# Altium project MU_MP_39_V1.PrjPcb (part 4 of 5)

## Sheet 15 ETHERNET.SchDoc
size 420 x 297 mm; Address1: Address1; Address2: Address2; Address3: Address3; Address4: Address4; DocumentNumber: АБВГ.123456.001 Э3; SheetNumber: 15; SheetTotal: 23; Scale: 1:1; DocumentType: Схема электрическая принципиальная; FirstReferrence: АБВГ.123456.001
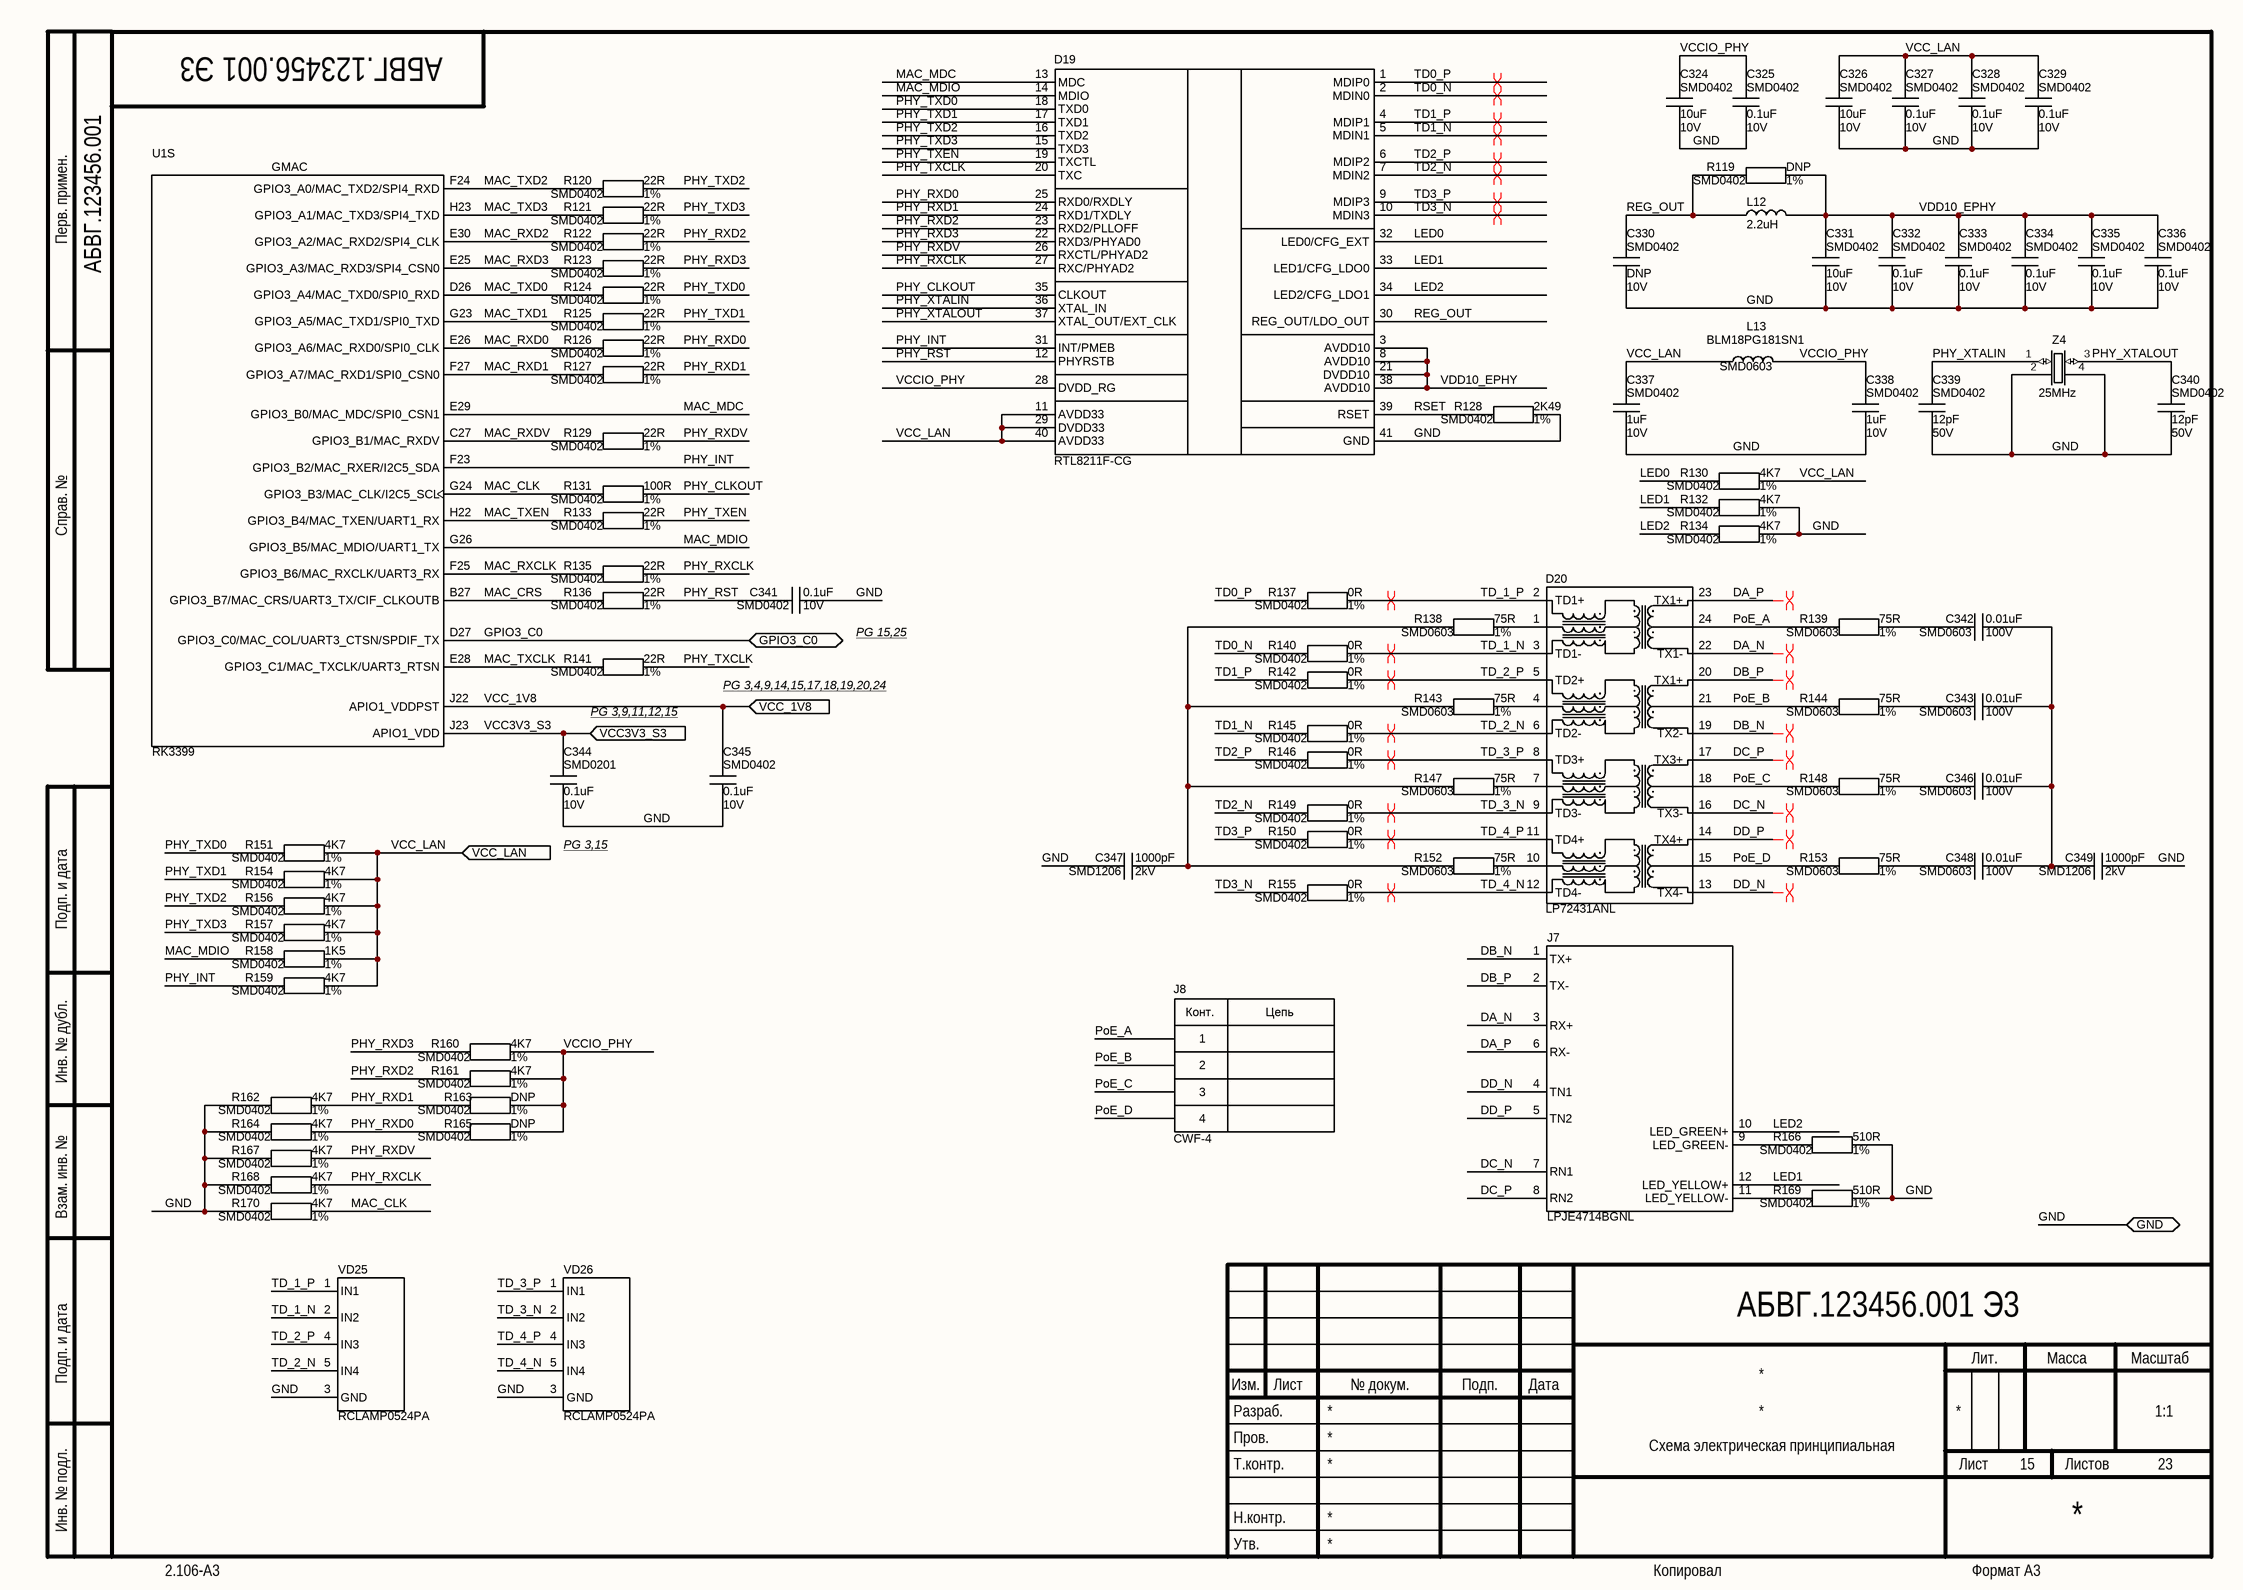
[diagram p14: 15 ETHERNET.SchDoc]

### Parts
C324  Package: SMD0402  Voltage: 10V  [CAP_SMD_0402]  (hidden comment: 10uF)
C325  Package: SMD0402  Voltage: 10V  [CAP_SMD_0402]  (hidden comment: 0.1uF)
C326  Package: SMD0402  Voltage: 10V  [CAP_SMD_0402]  (hidden comment: 10uF)
C327  Package: SMD0402  Voltage: 10V  [CAP_SMD_0402]  (hidden comment: 0.1uF)
C328  Package: SMD0402  Voltage: 10V  [CAP_SMD_0402]  (hidden comment: 0.1uF)
C329  Package: SMD0402  Voltage: 10V  [CAP_SMD_0402]  (hidden comment: 0.1uF)
C330  Package: SMD0402  Voltage: 10V  [CAP_SMD_0402]  (hidden comment: DNP)
C331  Package: SMD0402  Voltage: 10V  [CAP_SMD_0402]  (hidden comment: 10uF)
C332  Package: SMD0402  Voltage: 10V  [CAP_SMD_0402]  (hidden comment: 0.1uF)
C333  Package: SMD0402  Voltage: 10V  [CAP_SMD_0402]  (hidden comment: 0.1uF)
C334  Package: SMD0402  Voltage: 10V  [CAP_SMD_0402]  (hidden comment: 0.1uF)
C335  Package: SMD0402  Voltage: 10V  [CAP_SMD_0402]  (hidden comment: 0.1uF)
C336  Package: SMD0402  Voltage: 10V  [CAP_SMD_0402]  (hidden comment: 0.1uF)
C337  Package: SMD0402  Voltage: 10V  [CAP_SMD_0402]  (hidden comment: 1uF)
C338  Package: SMD0402  Voltage: 10V  [CAP_SMD_0402]  (hidden comment: 1uF)
C339  Package: SMD0402  Voltage: 50V  [CAP_SMD_0402]  (hidden comment: 12pF)
C340  Package: SMD0402  Voltage: 50V  [CAP_SMD_0402]  (hidden comment: 12pF)
C341  Package: SMD0402  Voltage: 10V  [CAP_SMD_0402]  (hidden comment: 0.1uF)
C342  Package: SMD0603  Voltage: 100V  [CAP_SMD_0603]  (hidden comment: 0.01uF)
C343  Package: SMD0603  Voltage: 100V  [CAP_SMD_0603]  (hidden comment: 0.01uF)
C344  Package: SMD0201  Voltage: 10V  [CAP_SMD_0201]  (hidden comment: 0.1uF)
C345  Package: SMD0402  Voltage: 10V  [CAP_SMD_0402]  (hidden comment: 0.1uF)
C346  Package: SMD0603  Voltage: 100V  [CAP_SMD_0603]  (hidden comment: 0.01uF)
C347  Package: SMD1206  Voltage: 2kV  [CAP_SMD_1206]  (hidden comment: 1000pF)
C348  Package: SMD0603  Voltage: 100V  [CAP_SMD_0603]  (hidden comment: 0.01uF)
C349  Package: SMD1206  Voltage: 2kV  [CAP_SMD_1206]  (hidden comment: 1000pF)
D19  RTL8211F-CG  [QFN40]
D20  LP72431ANL  [LP72431ANL]
J7  LPJE4714BGNL  [LPJE4714BGNL]
J8  CWF-4  [CWF-4]
L12  value 2.2uH  [IND_SMD_252012]  (hidden comment: Value)
L13  value BLM18PG181SN1  Package: SMD0603  [IND_SMD_0603]  (hidden comment: Value)
R119  Package: SMD0402  Tolerance: 1%  [RES_SMD_0402]  (hidden comment: DNP)
R120  Package: SMD0402  Tolerance: 1%  [RES_SMD_0402]  (hidden comment: 22R)
R121  Package: SMD0402  Tolerance: 1%  [RES_SMD_0402]  (hidden comment: 22R)
R122  Package: SMD0402  Tolerance: 1%  [RES_SMD_0402]  (hidden comment: 22R)
R123  Package: SMD0402  Tolerance: 1%  [RES_SMD_0402]  (hidden comment: 22R)
R124  Package: SMD0402  Tolerance: 1%  [RES_SMD_0402]  (hidden comment: 22R)
R125  Package: SMD0402  Tolerance: 1%  [RES_SMD_0402]  (hidden comment: 22R)
R126  Package: SMD0402  Tolerance: 1%  [RES_SMD_0402]  (hidden comment: 22R)
R127  Package: SMD0402  Tolerance: 1%  [RES_SMD_0402]  (hidden comment: 22R)
R128  Package: SMD0402  Tolerance: 1%  [RES_SMD_0402]  (hidden comment: 2K49)
R129  Package: SMD0402  Tolerance: 1%  [RES_SMD_0402]  (hidden comment: 22R)
R130  Package: SMD0402  Tolerance: 1%  [RES_SMD_0402]  (hidden comment: 4K7)
R131  Package: SMD0402  Tolerance: 1%  [RES_SMD_0402]  (hidden comment: 100R)
R132  Package: SMD0402  Tolerance: 1%  [RES_SMD_0402]  (hidden comment: 4K7)
R133  Package: SMD0402  Tolerance: 1%  [RES_SMD_0402]  (hidden comment: 22R)
R134  Package: SMD0402  Tolerance: 1%  [RES_SMD_0402]  (hidden comment: 4K7)
R135  Package: SMD0402  Tolerance: 1%  [RES_SMD_0402]  (hidden comment: 22R)
R136  Package: SMD0402  Tolerance: 1%  [RES_SMD_0402]  (hidden comment: 22R)
R137  Package: SMD0402  Tolerance: 1%  [RES_SMD_0402]  (hidden comment: 0R)
R138  Package: SMD0603  Tolerance: 1%  [RES_SMD_0603]  (hidden comment: 75R)
R139  Package: SMD0603  Tolerance: 1%  [RES_SMD_0603]  (hidden comment: 75R)
R140  Package: SMD0402  Tolerance: 1%  [RES_SMD_0402]  (hidden comment: 0R)
R141  Package: SMD0402  Tolerance: 1%  [RES_SMD_0402]  (hidden comment: 22R)
R142  Package: SMD0402  Tolerance: 1%  [RES_SMD_0402]  (hidden comment: 0R)
R143  Package: SMD0603  Tolerance: 1%  [RES_SMD_0603]  (hidden comment: 75R)
R144  Package: SMD0603  Tolerance: 1%  [RES_SMD_0603]  (hidden comment: 75R)
R145  Package: SMD0402  Tolerance: 1%  [RES_SMD_0402]  (hidden comment: 0R)
R146  Package: SMD0402  Tolerance: 1%  [RES_SMD_0402]  (hidden comment: 0R)
R147  Package: SMD0603  Tolerance: 1%  [RES_SMD_0603]  (hidden comment: 75R)
R148  Package: SMD0603  Tolerance: 1%  [RES_SMD_0603]  (hidden comment: 75R)
R149  Package: SMD0402  Tolerance: 1%  [RES_SMD_0402]  (hidden comment: 0R)
R150  Package: SMD0402  Tolerance: 1%  [RES_SMD_0402]  (hidden comment: 0R)
R151  Package: SMD0402  Tolerance: 1%  [RES_SMD_0402]  (hidden comment: 4K7)
R152  Package: SMD0603  Tolerance: 1%  [RES_SMD_0603]  (hidden comment: 75R)
R153  Package: SMD0603  Tolerance: 1%  [RES_SMD_0603]  (hidden comment: 75R)
R154  Package: SMD0402  Tolerance: 1%  [RES_SMD_0402]  (hidden comment: 4K7)
R155  Package: SMD0402  Tolerance: 1%  [RES_SMD_0402]  (hidden comment: 0R)
R156  Package: SMD0402  Tolerance: 1%  [RES_SMD_0402]  (hidden comment: 4K7)
R157  Package: SMD0402  Tolerance: 1%  [RES_SMD_0402]  (hidden comment: 4K7)
R158  Package: SMD0402  Tolerance: 1%  [RES_SMD_0402]  (hidden comment: 1K5)
R159  Package: SMD0402  Tolerance: 1%  [RES_SMD_0402]  (hidden comment: 4K7)
R160  Package: SMD0402  Tolerance: 1%  [RES_SMD_0402]  (hidden comment: 4K7)
R161  Package: SMD0402  Tolerance: 1%  [RES_SMD_0402]  (hidden comment: 4K7)
R162  Package: SMD0402  Tolerance: 1%  [RES_SMD_0402]  (hidden comment: 4K7)
R163  Package: SMD0402  Tolerance: 1%  [RES_SMD_0402]  (hidden comment: DNP)
R164  Package: SMD0402  Tolerance: 1%  [RES_SMD_0402]  (hidden comment: 4K7)
R165  Package: SMD0402  Tolerance: 1%  [RES_SMD_0402]  (hidden comment: DNP)
R166  Package: SMD0402  Tolerance: 1%  [RES_SMD_0402]  (hidden comment: 510R)
R167  Package: SMD0402  Tolerance: 1%  [RES_SMD_0402]  (hidden comment: 4K7)
R168  Package: SMD0402  Tolerance: 1%  [RES_SMD_0402]  (hidden comment: 4K7)
R169  Package: SMD0402  Tolerance: 1%  [RES_SMD_0402]  (hidden comment: 510R)
R170  Package: SMD0402  Tolerance: 1%  [RES_SMD_0402]  (hidden comment: 4K7)
U1  value RK3399  [BGA828C65P31X31_2100X2100X161N]  (hidden comment: RK3399_FF)  (part S of 23)
VD25  RCLAMP0524PA  [RCLAMP0524PA]
VD26  RCLAMP0524PA  [RCLAMP0524PA]
Z4  value 25MHz  [TSX3225]  (hidden comment: Value)

### Ports
GND (bidir), GPIO3_C0 (bidir), VCC3V3_S3 (in), VCC_1V8 (in), VCC_LAN (in)

### Nets
DA_N: D20.22(TX1-) J7.3(RX+)
DA_P: D20.23(TX1+) J7.6(RX-)
DB_N: D20.19(TX2-) J7.1(TX+)
DB_P: D20.20(TX1+) J7.2(TX-)
DC_N: D20.16(TX3-) J7.7(RN1)
DC_P: D20.17(TX3+) J7.8(RN2)
DD_N: D20.13(TX4-) J7.4(TN1)
DD_P: D20.14(TX4+) J7.5(TN2)
GND: C324.2 C325.2 C326.2 C327.2 C328.2 C329.2 C330.2 C331.2 C332.2 C333.2 C334.2 C335.2 C336.2 C337.2 C338.2 C339.2 C340.2 C341.2 C344.2 C345.2 C347.2 C349.1 D19.41(GND) R128.2 R132.2 R134.2 R162.1 R164.1 R166.2 R167.1 R168.1 R169.2 R170.1 VD25.3(GND) VD26.3(GND) Z4.2(GND) Z4.4(GND) ; port GND
GPIO3_C0: U1.D27(GPIO3_C0/MAC_COL/UART3_CTSN/SPDIF_TX) ; port GPIO3_C0
LED0: D19.32(LED0/CFG_EXT) R130.1
LED1: D19.33(LED1/CFG_LDO0) J7.12(LED_YELLOW+) R132.1
LED2: D19.34(LED2/CFG_LDO1) J7.10(LED_GREEN+) R134.1
MAC_CLK: R131.1 R170.2 U1.G24(GPIO3_B3/MAC_CLK/I2C5_SCL)
MAC_CRS: R136.2 U1.B27(GPIO3_B7/MAC_CRS/UART3_TX/CIF_CLKOUTB)
MAC_MDC: D19.13(MDC) U1.E29(GPIO3_B0/MAC_MDC/SPI0_CSN1)
MAC_MDIO: D19.14(MDIO) R158.1 U1.G26(GPIO3_B5/MAC_MDIO/UART1_TX)
MAC_RXCLK: R135.2 U1.F25(GPIO3_B6/MAC_RXCLK/UART3_RX)
MAC_RXD0: R126.2 U1.E26(GPIO3_A6/MAC_RXD0/SPI0_CLK)
MAC_RXD1: R127.2 U1.F27(GPIO3_A7/MAC_RXD1/SPI0_CSN0)
MAC_RXD2: R122.2 U1.E30(GPIO3_A2/MAC_RXD2/SPI4_CLK)
MAC_RXD3: R123.2 U1.E25(GPIO3_A3/MAC_RXD3/SPI4_CSN0)
MAC_RXDV: R129.2 U1.C27(GPIO3_B1/MAC_RXDV)
MAC_TXCLK: R141.2 U1.E28(GPIO3_C1/MAC_TXCLK/UART3_RTSN)
MAC_TXD0: R124.2 U1.D26(GPIO3_A4/MAC_TXD0/SPI0_RXD)
MAC_TXD1: R125.2 U1.G23(GPIO3_A5/MAC_TXD1/SPI0_TXD)
MAC_TXD2: R120.2 U1.F24(GPIO3_A0/MAC_TXD2/SPI4_RXD)
MAC_TXD3: R121.2 U1.H23(GPIO3_A1/MAC_TXD3/SPI4_TXD)
MAC_TXEN: R133.2 U1.H22(GPIO3_B4/MAC_TXEN/UART1_RX)
PHY_CLKOUT: D19.35(CLKOUT) R131.2
PHY_INT: D19.31(INT/PMEB) R159.1 U1.F23(GPIO3_B2/MAC_RXER/I2C5_SDA)
PHY_RST: C341.1 D19.12(PHYRSTB) R136.1
PHY_RXCLK: D19.27(RXC/PHYAD2) R135.1 R168.2
PHY_RXD0: D19.25(RXD0/RXDLY) R126.1 R164.2 R165.1
PHY_RXD1: D19.24(RXD1/TXDLY) R127.1 R162.2 R163.1
PHY_RXD2: D19.23(RXD2/PLLOFF) R122.1 R161.1
PHY_RXD3: D19.22(RXD3/PHYAD0) R123.1 R160.1
PHY_RXDV: D19.26(RXCTL/PHYAD2) R129.1 R167.2
PHY_TXCLK: D19.20(TXC) R141.1
PHY_TXD0: D19.18(TXD0) R124.1 R151.1
PHY_TXD1: D19.17(TXD1) R125.1 R154.1
PHY_TXD2: D19.16(TXD2) R120.1 R156.1
PHY_TXD3: D19.15(TXD3) R121.1 R157.1
PHY_TXEN: D19.19(TXCTL) R133.1
PHY_XTALIN: C339.1 D19.36(XTAL_IN) Z4.1(IN/OUT)
PHY_XTALOUT: C340.1 D19.37(XTAL_OUT/EXT_CLK) Z4.3(IN/OUT)
PoE_A: D20.24(TCT_1) J8.1 R139.1
PoE_B: D20.21(TCT_2) J8.2 R144.1
PoE_C: D20.18(TCT_3) J8.3 R148.1
PoE_D: D20.15(TCT_4) J8.4 R153.1
REG_OUT: C330.1 D19.30(REG_OUT/LDO_OUT) L12.2 R119.1
RSET: D19.39(RSET) R128.1
TD0_N: D19.2(MDIN0) R140.1
TD0_P: D19.1(MDIP0) R137.1
TD1_N: D19.5(MDIN1) R145.1
TD1_P: D19.4(MDIP1) R142.1
TD2_N: D19.7(MDIN2) R149.1
TD2_P: D19.6(MDIP2) R146.1
TD3_N: D19.10(MDIN3) R155.1
TD3_P: D19.9(MDIP3) R150.1
TD_1_N: D20.3(TD1-) R140.2 VD25.2(IN2)
TD_1_P: D20.2(TD1+) R137.2 VD25.1(IN1)
TD_2_N: D20.6(TD2-) R145.2 VD25.5(IN4)
TD_2_P: D20.5(TD2+) R142.2 VD25.4(IN3)
TD_3_N: D20.9(TD3-) R149.2 VD26.2(IN2)
TD_3_P: D20.8(TD3+) R146.2 VD26.1(IN1)
TD_4_N: D20.12(TD4-) R155.2 VD26.5(IN4)
TD_4_P: D20.11(TD4+) R150.2 VD26.4(IN3)
VCC3V3_S3: C344.1 U1.J23(APIO1_VDD) ; port VCC3V3_S3
VCC_1V8: C345.1 U1.J22(APIO1_VDDPST) ; port VCC_1V8
VCC_LAN: C326.1 C327.1 C328.1 C329.1 C337.1 D19.11(AVDD33) D19.29(DVDD33) D19.40(AVDD33) L13.2 R130.2 R151.2 R154.2 R156.2 R157.2 R158.2 R159.2 ; port VCC_LAN
VCCIO_PHY: C324.1 C325.1 C338.1 D19.28(DVDD_RG) L13.1 R160.2 R161.2 R163.2 R165.2
VDD10_EPHY: C331.1 C332.1 C333.1 C334.1 C335.1 C336.1 D19.3(AVDD10) D19.8(AVDD10) D19.21(DVDD10) D19.38(AVDD10) L12.1 R119.2
NetC342_1: C342.1 C343.1 C346.1 C348.1 C349.2
NetC342_2: C342.2 R139.2
NetC343_2: C343.2 R144.2
NetC346_2: C346.2 R148.2
NetC347_1: C347.1 R138.2 R143.2 R147.2 R152.2
NetC348_2: C348.2 R153.2
NetD20_1: D20.1(TCT1) R138.1
NetD20_4: D20.4(TCT2) R143.1
NetD20_7: D20.7(TCT3) R147.1
NetD20_10: D20.10(TCT4) R152.1
NetJ7_9: J7.9(LED_GREEN-) R166.1
NetJ7_11: J7.11(LED_YELLOW-) R169.1

### Layout directives
differential pair; differential pair class DiffPair_1; net class DiffPair_1: DA_N, DA_P, DB_N, DB_P, DC_N, DC_P, DD_N, DD_P, TD0_N, TD0_P, TD1_N, TD1_P, TD2_N, TD2_P, TD3_N, TD3_P, TD_1_N, TD_1_P, TD_2_N, TD_2_P, TD_3_N, TD_3_P, TD_4_N, TD_4_P

### Notes on the sheet
- Перв. примен.
- Справ. №
- PG 15,25
- PG 3,9,11,12,15
- PG 3,4,9,14,15,17,18,19,20,24
- PG 3,15
- Подп. и дата
- Инв. № дубл.
- Взам. инв. №
- Разраб.
- Изм.
- Лист
- № докум.
- Подп.
- Дата
- Лит.
- Масса
- Масштаб
- Пров.
- Т.контр.
- Листов
- Инв. № подл.
- Утв.
- Н.контр.
- 2.106-A3
- Копировал
- Формат А3
- (in symbol CON4) Конт.; Цепь
- (in symbol RK3399_FF, part S) GMAC

### Library data of the parts
C324 C326 C331 = Ceramic_Cap: PartNumber: CC0402MRX5R6BB106; ComponentType: SMD Ceramic Chip Capacitor; Manufacter: *; Tolerance: *; ClassName: *; Value: 10uF
C325 C327-C330 C332-C336 C341 C345 = Ceramic_Cap: PartNumber: CC0402KRX5R6BB104; ComponentType: SMD Ceramic Chip Capacitor; Manufacter: *; Tolerance: *; ClassName: *
  C325 C327-C329 C332-C336 C341 C345: Value: 0.1uF
  C330: Value: DNP
C337 C338 = Ceramic_Cap: PartNumber: CC0402KRX5R6BB105; ComponentType: SMD Ceramic Chip Capacitor; Manufacter: *; Tolerance: *; ClassName: *; Value: 1uF
C339 C340 = Ceramic_Cap: PartNumber: CC0402JRNPO9BN120; ComponentType: SMD Ceramic Chip Capacitor; Manufacter: *; Tolerance: *; ClassName: *; Value: 12pF
C342 C343 C346 C348 = Ceramic_Cap: PartNumber: CC0603KRX7R0BB103; ComponentType: SMD Ceramic Chip Capacitor; Manufacter: *; Tolerance: *; ClassName: *; Value: 0.01uF
C344 = Ceramic_Cap: PartNumber: CC0201KRX5R6BB104; ComponentType: SMD Ceramic Chip Capacitor; Manufacter: *; Tolerance: *; ClassName: *; Value: 0.1uF
C347 C349 = Ceramic_Cap: PartNumber: CC1206MKX7RDBB102; ComponentType: SMD Ceramic Chip Capacitor; Manufacter: *; Tolerance: *; ClassName: *; Value: 1000pF
J8 = CON4: PartNumber: DS1069-4MVW6X (CWF-4); Manufacter: *; Package: CWF-4; ClassName: *; Value: CWF-4
L12 = Inductor_smal: PartNumber: DFE252012P-2R2M=P2; ComponentType: *; Manufacter: *; Package: SMD252012; ClassName: *
L13 = Inductor_smal: ComponentType: *; Manufacter: *; PartNumber: BLM18PG181SN1; ClassName: *
R119 R163 R165 = Chip_Res: PartNumber: Do Not Place; ComponentType: SMD Chip Resistor; Manufacter: *; Voltage: *; ClassName: *; Value: DNP
R120-R127 R129 R133 R135 R136 R141 = Chip_Res: PartNumber: RC0402FR-0722RL; ComponentType: SMD Chip Resistor; Manufacter: *; Voltage: *; ClassName: *; Value: 22R
R128 = Chip_Res: PartNumber: RC0402FR-072K49L; ComponentType: SMD Chip Resistor; Manufacter: *; Voltage: *; ClassName: *; Value: 2K49
R130 R132 R134 R151 R154 R156 R157 R159-R162 R164 R167 R168 R170 = Chip_Res: PartNumber: RC0402FR-074K7L; ComponentType: SMD Chip Resistor; Manufacter: *; Voltage: *; ClassName: *; Value: 4K7
R131 = Chip_Res: PartNumber: RC0402FR-07100RL; ComponentType: SMD Chip Resistor; Manufacter: *; Voltage: *; ClassName: *; Value: 100R
R137 R140 R142 R145 R146 R149 R150 R155 = Chip_Res: PartNumber: RC0402FR-070RL; ComponentType: SMD Chip Resistor; Manufacter: *; Voltage: *; ClassName: *; Value: 0R
R138 R139 R143 R144 R147 R148 R152 R153 = Chip_Res: PartNumber: RC0603FR-0775RL; ComponentType: SMD Chip Resistor; Manufacter: *; Voltage: *; ClassName: *; Value: 75R
R158 = Chip_Res: PartNumber: RC0402FR-071K5L; ComponentType: SMD Chip Resistor; Manufacter: *; Voltage: *; ClassName: *; Value: 1K5
R166 R169 = Chip_Res: PartNumber: RC0402FR-07510RL; ComponentType: SMD Chip Resistor; Manufacter: *; Voltage: *; ClassName: *; Value: 510R
Z4 = OSC3225: PartNumber: X322525MOB4SI; ComponentType: *; Manufacter: *; Package: TSX3225
D19 = RTL8211F-CG: ComponentType: SMD Chip Resistor; Manufacter: *; Voltage: *; ClassName: *; Tolerance: *; PartNumber: RTL8211F-CG; Package: QFN40; Value: RTL8211F-CG
D20 = LP72431ANL: ComponentType: *; Manufacter: *; Voltage: *; ClassName: *; Tolerance: *; PartNumber: LP72431ANL; Package: LP72431ANL; Value: LP72431ANL
J7 = LPJE4714BGNL: ComponentType: *; Manufacter: *; Voltage: *; ClassName: *; Tolerance: *; PartNumber: LPJE4714BGNL; Package: LPJE4714BGNL; Value: LPJE4714BGNL
U1 = RK3399_FF: Package: BGA828; ComponentType: *; Manufacter: *; PartNumber: RK3399; ClassName: *
VD25 VD26 = RCLAMP0524PA: ComponentType: *; Manufacter: *; Package: RCLAMP0524PA; PartNumber: RCLAMP0524PA; ClassName: *; Value: RCLAMP0524PA

## Sheet 16 HDMI.SchDoc
size 420 x 297 mm; Address1: Address1; Address2: Address2; Address3: Address3; Address4: Address4; DocumentNumber: АБВГ.123456.001 Э3; SheetNumber: 16; SheetTotal: 23; Scale: 1:1; DocumentType: Схема электрическая принципиальная; FirstReferrence: АБВГ.123456.001
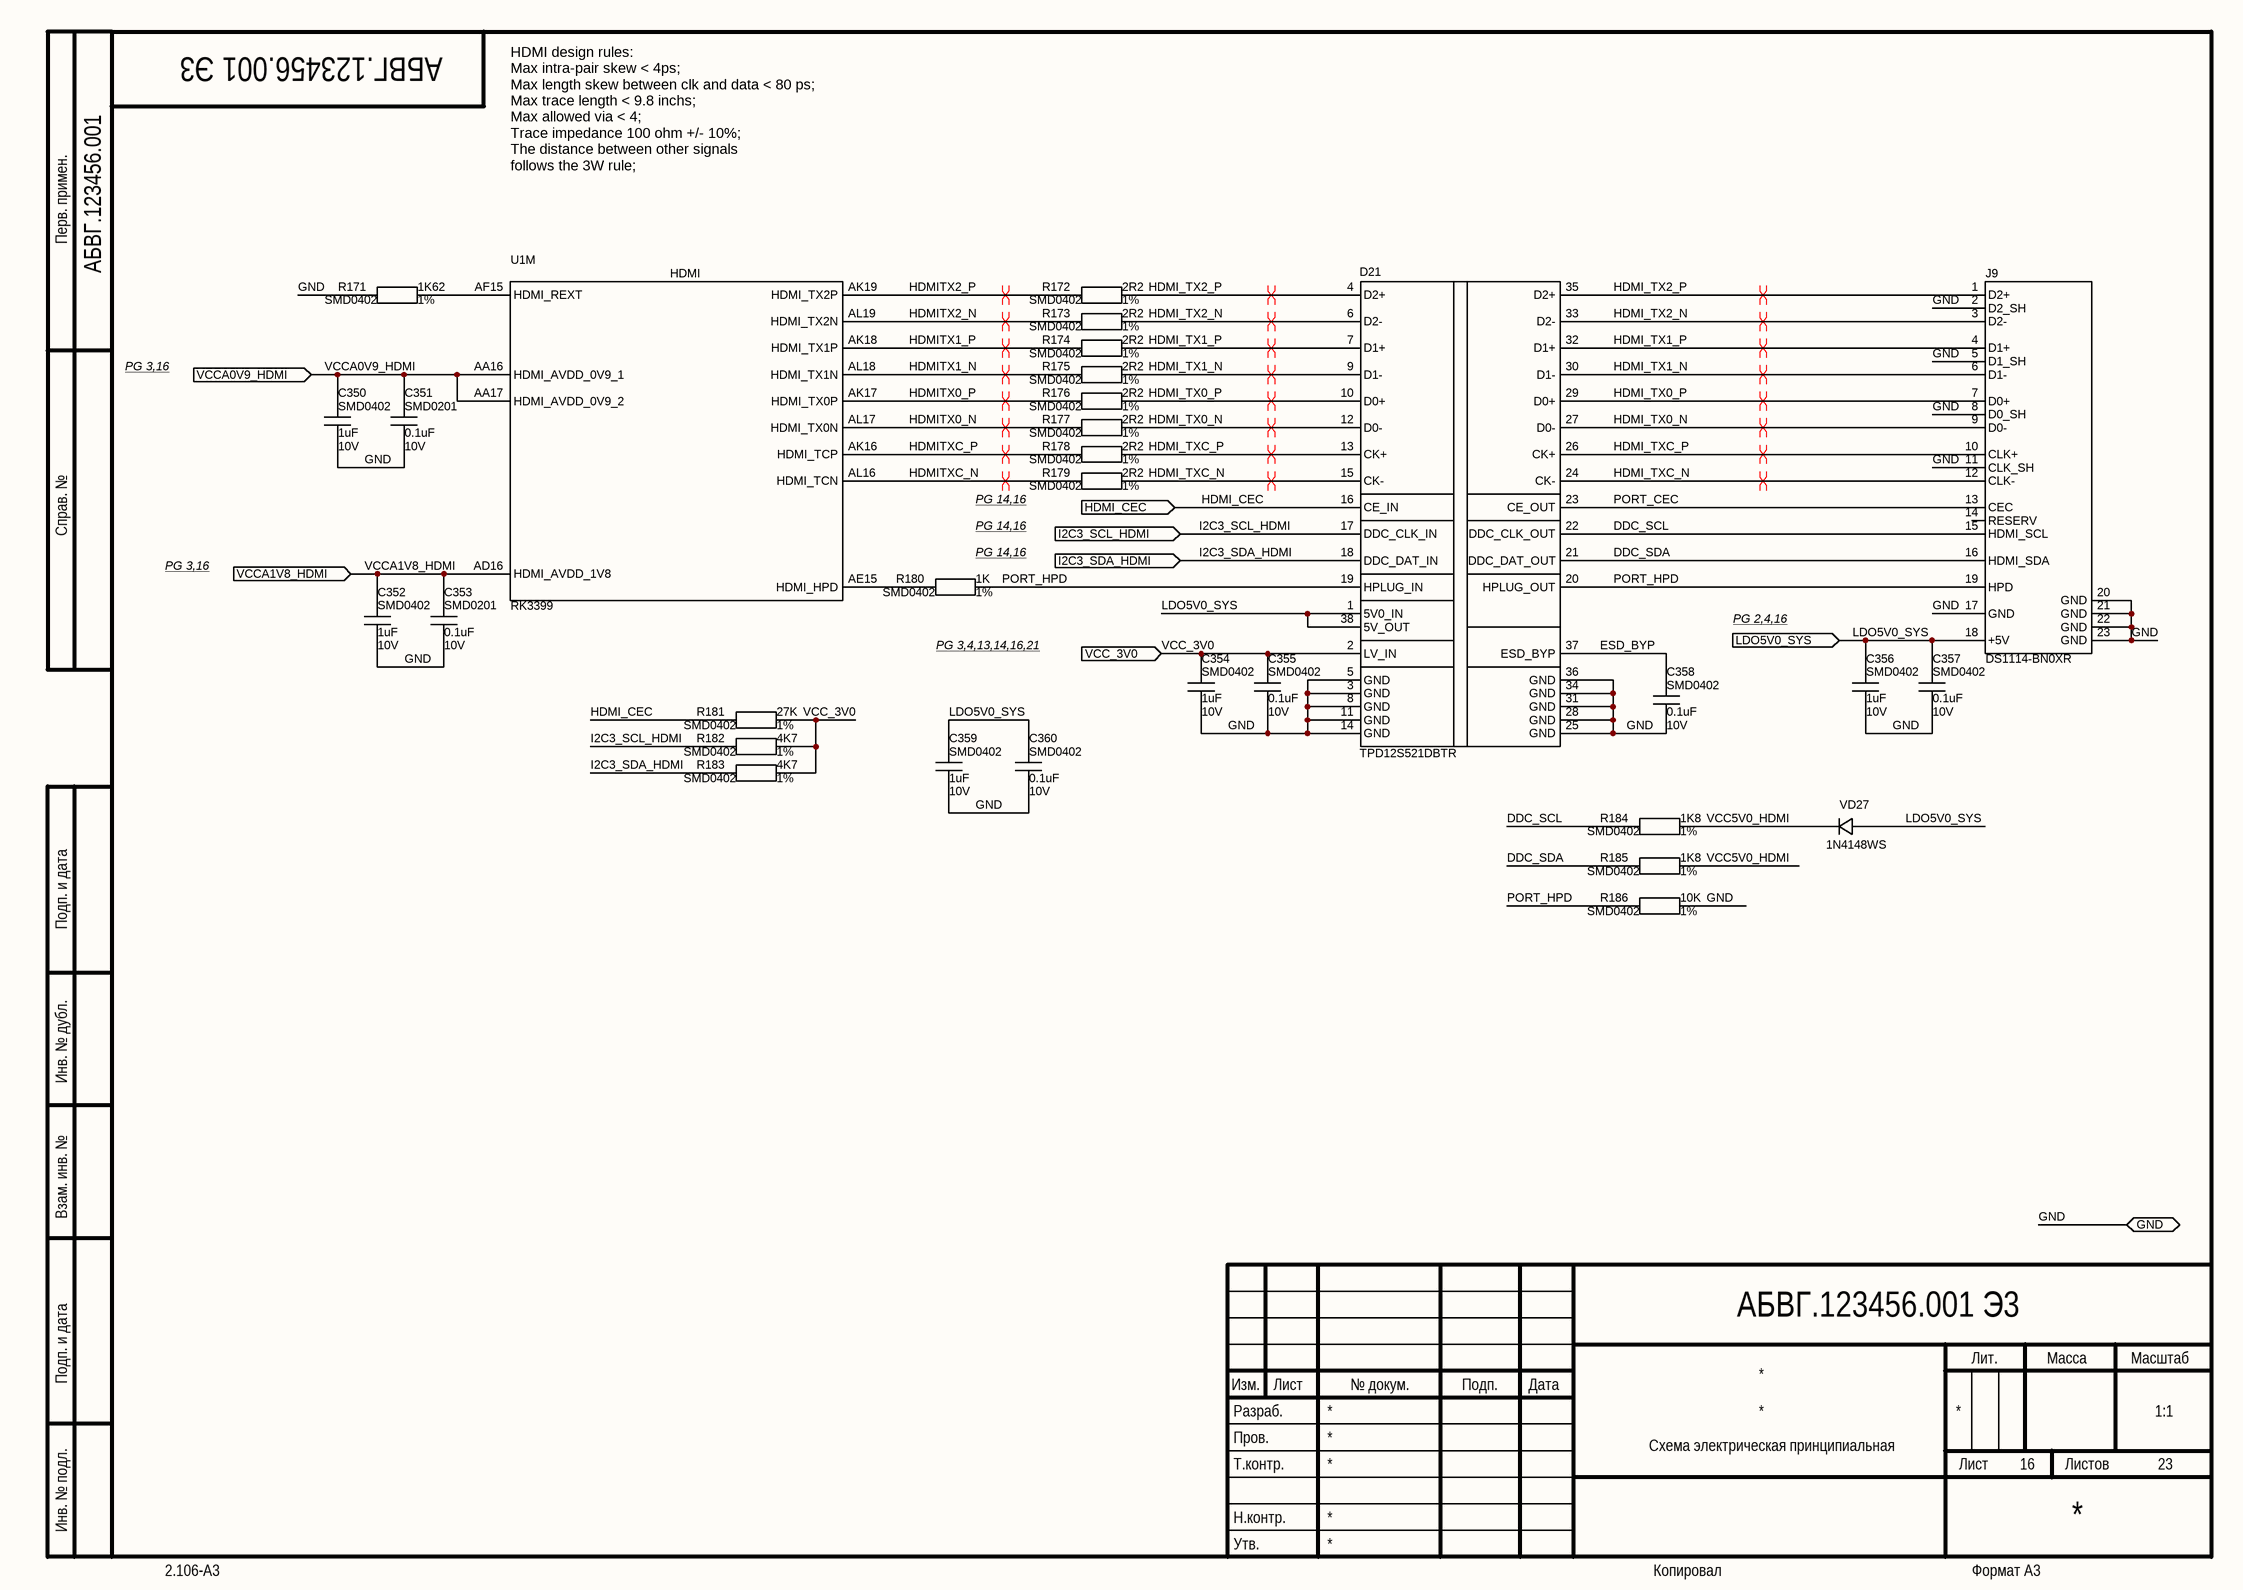
[diagram p15: 16 HDMI.SchDoc]

### Parts
C350  Package: SMD0402  Voltage: 10V  [CAP_SMD_0402]  (hidden comment: 1uF)
C351  Package: SMD0201  Voltage: 10V  [CAP_SMD_0201]  (hidden comment: 0.1uF)
C352  Package: SMD0402  Voltage: 10V  [CAP_SMD_0402_small]  (hidden comment: 1uF)
C353  Package: SMD0201  Voltage: 10V  [CAP_SMD_0201]  (hidden comment: 0.1uF)
C354  Package: SMD0402  Voltage: 10V  [CAP_SMD_0402]  (hidden comment: 1uF)
C355  Package: SMD0402  Voltage: 10V  [CAP_SMD_0402]  (hidden comment: 0.1uF)
C356  Package: SMD0402  Voltage: 10V  [CAP_SMD_0402]  (hidden comment: 1uF)
C357  Package: SMD0402  Voltage: 10V  [CAP_SMD_0402]  (hidden comment: 0.1uF)
C358  Package: SMD0402  Voltage: 10V  [CAP_SMD_0402]  (hidden comment: 0.1uF)
C359  Package: SMD0402  Voltage: 10V  [CAP_SMD_0402]  (hidden comment: 1uF)
C360  Package: SMD0402  Voltage: 10V  [CAP_SMD_0402]  (hidden comment: 0.1uF)
D21  TPD12S521DBTR  [TSSOP-38]
J9  DS1114-BN0XR  [DS1114-BN0XR]
R171  Package: SMD0402  Tolerance: 1%  [RES_SMD_0402_SMALL]  (hidden comment: 1K62)
R172  Package: SMD0402  Tolerance: 1%  [RES_SMD_0402]  (hidden comment: 2R2)
R173  Package: SMD0402  Tolerance: 1%  [RES_SMD_0402]  (hidden comment: 2R2)
R174  Package: SMD0402  Tolerance: 1%  [RES_SMD_0402]  (hidden comment: 2R2)
R175  Package: SMD0402  Tolerance: 1%  [RES_SMD_0402]  (hidden comment: 2R2)
R176  Package: SMD0402  Tolerance: 1%  [RES_SMD_0402]  (hidden comment: 2R2)
R177  Package: SMD0402  Tolerance: 1%  [RES_SMD_0402]  (hidden comment: 2R2)
R178  Package: SMD0402  Tolerance: 1%  [RES_SMD_0402]  (hidden comment: 2R2)
R179  Package: SMD0402  Tolerance: 1%  [RES_SMD_0402]  (hidden comment: 2R2)
R180  Package: SMD0402  Tolerance: 1%  [RES_SMD_0402]  (hidden comment: 1K)
R181  Package: SMD0402  Tolerance: 1%  [RES_SMD_0402]  (hidden comment: 27K)
R182  Package: SMD0402  Tolerance: 1%  [RES_SMD_0402]  (hidden comment: 4K7)
R183  Package: SMD0402  Tolerance: 1%  [RES_SMD_0402]  (hidden comment: 4K7)
R184  Package: SMD0402  Tolerance: 1%  [RES_SMD_0402]  (hidden comment: 1K8)
R185  Package: SMD0402  Tolerance: 1%  [RES_SMD_0402]  (hidden comment: 1K8)
R186  Package: SMD0402  Tolerance: 1%  [RES_SMD_0402]  (hidden comment: 10K)
U1  value RK3399  [BGA828C65P31X31_2100X2100X161N]  (hidden comment: RK3399_FF)  (part M of 23)
VD27  value 1N4148WS  [SOD323]  (hidden comment: Diode)

### Ports
GND (bidir), HDMI_CEC (in), I2C3_SCL_HDMI (in), I2C3_SDA_HDMI (in), LDO5V0_SYS (in), VCC_3V0 (in), VCCA0V9_HDMI (in), VCCA1V8_HDMI (in)

### Nets
DDC_SCL: D21.22(DDC_CLK_OUT) J9.15(HDMI_SCL) R184.1
DDC_SDA: D21.21(DDC_DAT_OUT) J9.16(HDMI_SDA) R185.1
ESD_BYP: C358.1 D21.37(ESD_BYP)
GND: C350.2 C351.2 C352.2 C353.2 C354.2 C355.2 C356.2 C357.2 C358.2 C359.2 C360.2 D21.3(GND) D21.5(GND) D21.8(GND) D21.11(GND) D21.14(GND) D21.25(GND) D21.28(GND) D21.31(GND) D21.34(GND) D21.36(GND) J9.2(D2_SH) J9.5(D1_SH) J9.8(D0_SH) J9.11(CLK_SH) J9.17(GND) J9.20(GND) J9.21(GND) J9.22(GND) J9.23(GND) R171.1 R186.1 ; port GND
HDMI_CEC: D21.16(CE_IN) R181.1 ; port HDMI_CEC
HDMI_TX0_N: D21.12(D0-) D21.27(D0-) J9.9(D0-) R177.2
HDMI_TX0_P: D21.10(D0+) D21.29(D0+) J9.7(D0+) R176.2
HDMI_TX1_N: D21.9(D1-) D21.30(D1-) J9.6(D1-) R175.2
HDMI_TX1_P: D21.7(D1+) D21.32(D1+) J9.4(D1+) R174.2
HDMI_TX2_N: D21.6(D2-) D21.33(D2-) J9.3(D2-) R173.2
HDMI_TX2_P: D21.4(D2+) D21.35(D2+) J9.1(D2+) R172.2
HDMI_TXC_N: D21.15(CK-) D21.24(CK-) J9.12(CLK-) R179.2
HDMI_TXC_P: D21.13(CK+) D21.26(CK+) J9.10(CLK+) R178.2
HDMITX0_N: R177.1 U1.AL17(HDMI_TX0N)
HDMITX0_P: R176.1 U1.AK17(HDMI_TX0P)
HDMITX1_N: R175.1 U1.AL18(HDMI_TX1N)
HDMITX1_P: R174.1 U1.AK18(HDMI_TX1P)
HDMITX2_N: R173.1 U1.AL19(HDMI_TX2N)
HDMITX2_P: R172.1 U1.AK19(HDMI_TX2P)
HDMITXC_N: R179.1 U1.AL16(HDMI_TCN)
HDMITXC_P: R178.1 U1.AK16(HDMI_TCP)
I2C3_SCL_HDMI: D21.17(DDC_CLK_IN) R182.1 ; port I2C3_SCL_HDMI
I2C3_SDA_HDMI: D21.18(DDC_DAT_IN) R183.1 ; port I2C3_SDA_HDMI
LDO5V0_SYS: C356.1 C357.1 C359.1 C360.1 D21.1(5V0_IN) D21.38(5V_OUT) J9.18(+5V) VD27.1(A) ; port LDO5V0_SYS
PORT_CEC: D21.23(CE_OUT) J9.13(CEC)
PORT_HPD: D21.19(HPLUG_IN) D21.20(HPLUG_OUT) J9.19(HPD) R180.2 R186.2
VCC5V0_HDMI: R184.2 R185.2 VD27.2(C)
VCC_3V0: C354.1 C355.1 D21.2(LV_IN) R181.2 R182.2 R183.2 ; port VCC_3V0
VCCA0V9_HDMI: C350.1 C351.1 U1.AA16(HDMI_AVDD_0V9_1) U1.AA17(HDMI_AVDD_0V9_2) ; port VCCA0V9_HDMI
VCCA1V8_HDMI: C352.1 C353.1 U1.AD16(HDMI_AVDD_1V8) ; port VCCA1V8_HDMI
NetR171_2: R171.2 U1.AF15(HDMI_REXT)
NetR180_1: R180.1 U1.AE15(HDMI_HPD)

Not connected (* = marked no-connect by the designer): J9 14(RESERV)

### Layout directives
differential pair; differential pair class DiffPair_1; net class DiffPair_1: HDMI_TX0_N, HDMI_TX0_P, HDMI_TX1_N, HDMI_TX1_P, HDMI_TX2_N, HDMI_TX2_P, HDMI_TXC_N, HDMI_TXC_P, HDMITX0_N, HDMITX0_P, HDMITX1_N, HDMITX1_P, HDMITX2_N, HDMITX2_P, HDMITXC_N, HDMITXC_P

### Notes on the sheet
- HDMI design rules:
  Max intra-pair skew < 4ps;
  Max length skew between clk and data < 80 ps;
  Max trace length < 9.8 inchs;
  Max allowed via < 4;
  Trace impedance 100 ohm +/- 10%;
  The distance between other signals
  follows the 3W rule;
- Перв. примен.
- PG 3,16
- Справ. №
- PG 14,16
- (near R180) PG 14,16
- (near R180) PG 3,4,13,14,16,21
- PG 2,4,16
- Подп. и дата
- Инв. № дубл.
- Взам. инв. №
- Разраб.
- Изм.
- Лист
- № докум.
- Подп.
- Дата
- Лит.
- Масса
- Масштаб
- Пров.
- Т.контр.
- Листов
- Инв. № подл.
- Утв.
- Н.контр.
- 2.106-A3
- Копировал
- Формат А3
- (in symbol RK3399_FF, part M) HDMI

### Library data of the parts
C350 C352 C354 C356 C359 = Ceramic_Cap: PartNumber: CC0402KRX5R6BB105; ComponentType: SMD Ceramic Chip Capacitor; Manufacter: *; Tolerance: *; Value: 1uF
  C350 C354 C356 C359: ClassName: *
  C352: ClassName: Solder_Clearence
C351 C353 = Ceramic_Cap: PartNumber: CC0201KRX5R6BB104; ComponentType: SMD Ceramic Chip Capacitor; Manufacter: *; Tolerance: *; ClassName: *; Value: 0.1uF
C355 C357 C358 C360 = Ceramic_Cap: PartNumber: CC0402KRX5R6BB104; ComponentType: SMD Ceramic Chip Capacitor; Manufacter: *; Tolerance: *; ClassName: *; Value: 0.1uF
J9 = HDMI_A_1: ComponentType: *; Manufacter: *; Package: DS1114-BN0XR; PartNumber: DS1114-BN0XR; ClassName: *; Value: DS1114-BN0XR
R171 = Chip_Res: PartNumber: RC0402FR-071K62L; ComponentType: SMD Chip Resistor; Manufacter: *; Voltage: *; ClassName: Solder_Clearence; Value: 1K62
R172-R179 = Chip_Res: PartNumber: RC0402FR-072R2L; ComponentType: SMD Chip Resistor; Manufacter: *; Voltage: *; ClassName: *; Value: 2R2
R180 = Chip_Res: PartNumber: RC0402FR-071KL; ComponentType: SMD Chip Resistor; Manufacter: *; Voltage: *; ClassName: *; Value: 1K
R181 = Chip_Res: PartNumber: RC0402FR-0727KL; ComponentType: SMD Chip Resistor; Manufacter: *; Voltage: *; ClassName: *; Value: 27K
R182 R183 = Chip_Res: PartNumber: RC0402FR-074K7L; ComponentType: SMD Chip Resistor; Manufacter: *; Voltage: *; ClassName: *; Value: 4K7
R184 R185 = Chip_Res: PartNumber: RC0402FR-071K8L; ComponentType: SMD Chip Resistor; Manufacter: *; Voltage: *; ClassName: *; Value: 1K8
R186 = Chip_Res: PartNumber: RC0402FR-0710KL; ComponentType: SMD Chip Resistor; Manufacter: *; Voltage: *; ClassName: *; Value: 10K
D21 = TPD12S521DBTR: ComponentType: *; Manufacter: *; Package: TSSOP-38; PartNumber: TPD12S521DBTR; ClassName: *; Value: TPD12S521DBTR
U1 = RK3399_FF: Package: BGA828; ComponentType: *; Manufacter: *; PartNumber: RK3399; ClassName: *
VD27 = Diode: ComponentType: *; Manufacter: *; Package: SOD323; PartNumber: 1N4148WS; ClassName: *

## Sheet 17 EDP.SchDoc
size 420 x 297 mm; Address1: Address1; Address2: Address2; Address3: Address3; Address4: Address4; DocumentNumber: АБВГ.123456.001 Э3; SheetNumber: 17; SheetTotal: 23; Scale: 1:1; DocumentType: Схема электрическая принципиальная; FirstReferrence: АБВГ.123456.001
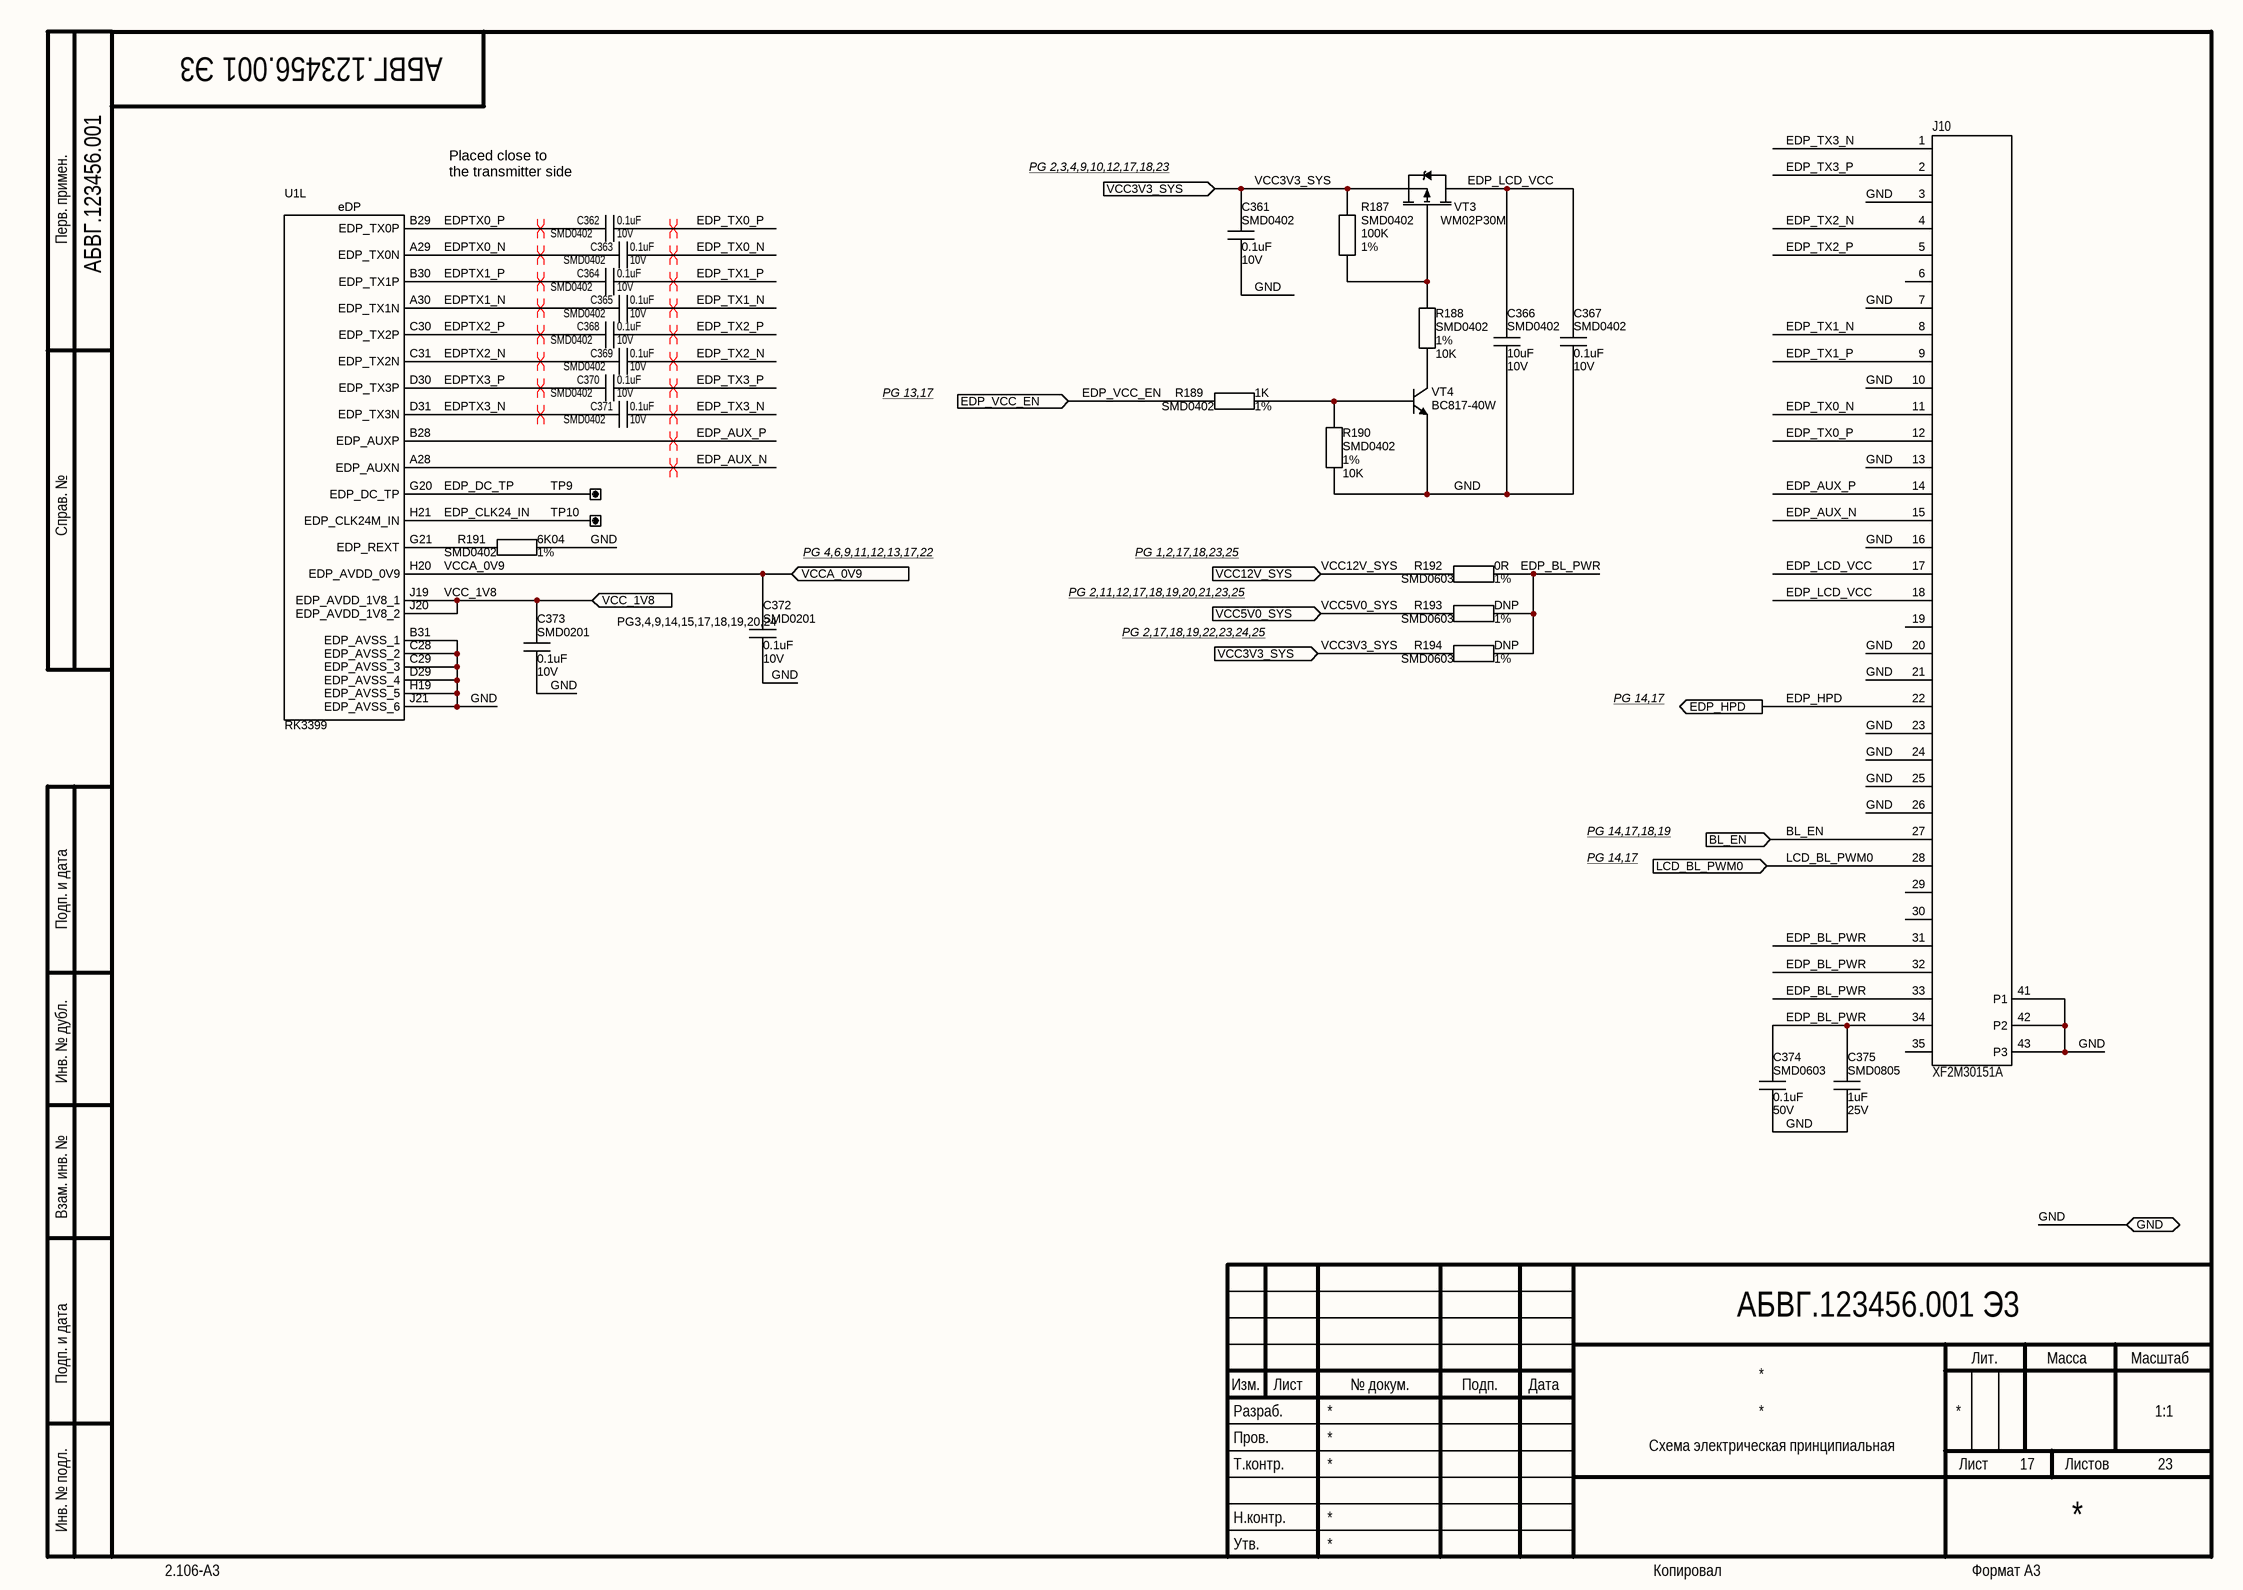
[diagram p16: 17 EDP.SchDoc]

### Parts
C361  Package: SMD0402  Voltage: 10V  [CAP_SMD_0402]  (hidden comment: 0.1uF)
C362  Package: SMD0402  Voltage: 10V  [CAP_SMD_0402_small]  (hidden comment: 0.1uF)
C363  Package: SMD0402  Voltage: 10V  [CAP_SMD_0402_small]  (hidden comment: 0.1uF)
C364  Package: SMD0402  Voltage: 10V  [CAP_SMD_0402_small]  (hidden comment: 0.1uF)
C365  Package: SMD0402  Voltage: 10V  [CAP_SMD_0402_small]  (hidden comment: 0.1uF)
C366  Package: SMD0402  Voltage: 10V  [CAP_SMD_0402]  (hidden comment: 10uF)
C367  Package: SMD0402  Voltage: 10V  [CAP_SMD_0402]  (hidden comment: 0.1uF)
C368  Package: SMD0402  Voltage: 10V  [CAP_SMD_0402_small]  (hidden comment: 0.1uF)
C369  Package: SMD0402  Voltage: 10V  [CAP_SMD_0402_small]  (hidden comment: 0.1uF)
C370  Package: SMD0402  Voltage: 10V  [CAP_SMD_0402_small]  (hidden comment: 0.1uF)
C371  Package: SMD0402  Voltage: 10V  [CAP_SMD_0402_small]  (hidden comment: 0.1uF)
C372  Package: SMD0201  Voltage: 10V  [CAP_SMD_0201]  (hidden comment: 0.1uF)
C373  Package: SMD0201  Voltage: 10V  [CAP_SMD_0201]  (hidden comment: 0.1uF)
C374  Package: SMD0603  Voltage: 50V  [CAP_SMD_0603]  (hidden comment: 0.1uF)
C375  Package: SMD0805  Voltage: 25V  [CAP_SMD_0805]  (hidden comment: 1uF)
J10  XF2M30151A  [XF2M-30_3515-1A]
R187  Package: SMD0402  Tolerance: 1%  [RES_SMD_0402]  (hidden comment: 100K)
R188  Package: SMD0402  Tolerance: 1%  [RES_SMD_0402]  (hidden comment: 10K)
R189  Package: SMD0402  Tolerance: 1%  [RES_SMD_0402]  (hidden comment: 1K)
R190  Package: SMD0402  Tolerance: 1%  [RES_SMD_0402]  (hidden comment: 10K)
R191  Package: SMD0402  Tolerance: 1%  [RES_SMD_0402]  (hidden comment: 6K04)
R192  Package: SMD0603  Tolerance: 1%  [RES_SMD_0603]  (hidden comment: 0R)
R193  Package: SMD0603  Tolerance: 1%  [RES_SMD_0603]  (hidden comment: DNP)
R194  Package: SMD0603  Tolerance: 1%  [RES_SMD_0603]  (hidden comment: DNP)
TP9  TEST POINT SMD 1MM  [TEST POINT SMD 1MM]  (value not drawn)
TP10  TEST POINT SMD 1MM  [TEST POINT SMD 1MM]  (value not drawn)
U1  value RK3399  [BGA828C65P31X31_2100X2100X161N]  (hidden comment: RK3399_FF)  (part L of 23)
VT3  value WM02P30M  [SOT23]  (hidden comment: Value)
VT4  BC817-40W  [SC-70]

### Ports
BL_EN (in), EDP_HPD (out), EDP_VCC_EN (in), GND (bidir), LCD_BL_PWM0 (in), VCC3V3_SYS (in), VCC5V0_SYS (in), VCC12V_SYS (in), VCC_1V8 (in), VCCA_0V9 (in)

### Nets
BL_EN: J10.27 ; port BL_EN
EDP_AUX_N: J10.15 U1.A28(EDP_AUXN)
EDP_AUX_P: J10.14 U1.B28(EDP_AUXP)
EDP_BL_PWR: C374.2 C375.2 J10.31 J10.32 J10.33 J10.34 R192.1 R193.1 R194.1
EDP_CLK24_IN: TP10.1 U1.H21(EDP_CLK24M_IN)
EDP_DC_TP: TP9.1 U1.G20(EDP_DC_TP)
EDP_HPD: J10.22 ; port EDP_HPD
EDP_LCD_VCC: C366.1 C367.1 J10.17 J10.18 VT3.3(D)
EDP_TX0_N: C363.1 J10.11
EDP_TX0_P: C362.1 J10.12
EDP_TX1_N: C365.1 J10.8
EDP_TX1_P: C364.1 J10.9
EDP_TX2_N: C369.1 J10.4
EDP_TX2_P: C368.1 J10.5
EDP_TX3_N: C371.1 J10.1
EDP_TX3_P: C370.1 J10.2
EDP_VCC_EN: R189.1 ; port EDP_VCC_EN
EDPTX0_N: C363.2 U1.A29(EDP_TX0N)
EDPTX0_P: C362.2 U1.B29(EDP_TX0P)
EDPTX1_N: C365.2 U1.A30(EDP_TX1N)
EDPTX1_P: C364.2 U1.B30(EDP_TX1P)
EDPTX2_N: C369.2 U1.C31(EDP_TX2N)
EDPTX2_P: C368.2 U1.C30(EDP_TX2P)
EDPTX3_N: C371.2 U1.D31(EDP_TX3N)
EDPTX3_P: C370.2 U1.D30(EDP_TX3P)
GND: C361.2 C366.2 C367.2 C372.2 C373.2 C374.1 C375.1 J10.3 J10.7 J10.10 J10.13 J10.16 J10.20 J10.21 J10.23 J10.24 J10.25 J10.26 J10.41(P1) J10.42(P2) J10.43(P3) R190.1 R191.2 U1.B31(EDP_AVSS_1) U1.C28(EDP_AVSS_2) U1.C29(EDP_AVSS_3) U1.D29(EDP_AVSS_4) U1.H19(EDP_AVSS_5) U1.J21(EDP_AVSS_6) VT4.2(E) ; port GND
LCD_BL_PWM0: J10.28 ; port LCD_BL_PWM0
VCC3V3_SYS: C361.1 R187.2 R194.2 VT3.2(S) ; port VCC3V3_SYS
VCC5V0_SYS: R193.2 ; port VCC5V0_SYS
VCC12V_SYS: R192.2 ; port VCC12V_SYS
VCC_1V8: C373.1 U1.J19(EDP_AVDD_1V8_1) U1.J20(EDP_AVDD_1V8_2) ; port VCC_1V8
VCCA_0V9: C372.1 U1.H20(EDP_AVDD_0V9) ; port VCCA_0V9
NetR187_1: R187.1 R188.2 VT3.1(G)
NetR188_1: R188.1 VT4.3(C)
NetR189_2: R189.2 R190.2 VT4.1(B)
NetR191_1: R191.1 U1.G21(EDP_REXT)

Not connected (* = marked no-connect by the designer): J10 6 19 29 30 35

### Layout directives
differential pair; net class DiffPair_90_Ohms; differential pair class DiffPair_90_Ohms: EDP_AUX_N, EDP_AUX_P, EDP_TX0_N, EDP_TX0_P, EDP_TX1_N, EDP_TX1_P, EDP_TX2_N, EDP_TX2_P, EDP_TX3_N, EDP_TX3_P, EDPTX0_N, EDPTX0_P, EDPTX1_N, EDPTX1_P, EDPTX2_N, EDPTX2_P, EDPTX3_N, EDPTX3_P

### Notes on the sheet
- Placed close to
  the transmitter side
- PG 2,3,4,9,10,12,17,18,23
- Перв. примен.
- PG 13,17
- Справ. №
- PG 4,6,9,11,12,13,17,22
- PG 2,11,12,17,18,19,20,21,23,25
- PG 1,2,17,18,23,25
- (near C372) PG3,4,9,14,15,17,18,19,20,24
- PG 2,17,18,19,22,23,24,25
- PG 14,17
- PG 14,17,18,19
- Подп. и дата
- Инв. № дубл.
- Взам. инв. №
- Разраб.
- Изм.
- Лист
- № докум.
- Подп.
- Дата
- Лит.
- Масса
- Масштаб
- Пров.
- Т.контр.
- Листов
- Инв. № подл.
- Утв.
- Н.контр.
- 2.106-A3
- Копировал
- Формат А3
- (in symbol RK3399_FF, part L) eDP

### Library data of the parts
C361-C365 C367-C371 = Ceramic_Cap: PartNumber: CC0402KRX5R6BB104; ComponentType: SMD Ceramic Chip Capacitor; Manufacter: *; Tolerance: *; Value: 0.1uF
  C361 C367: ClassName: *
  C362-C365 C368-C371: ClassName: Solder_Clearence
C366 = Ceramic_Cap: PartNumber: CC0402MRX5R6BB106; ComponentType: SMD Ceramic Chip Capacitor; Manufacter: *; Tolerance: *; ClassName: *; Value: 10uF
C372 C373 = Ceramic_Cap: PartNumber: CC0201KRX5R6BB104; ComponentType: SMD Ceramic Chip Capacitor; Manufacter: *; Tolerance: *; ClassName: *; Value: 0.1uF
C374 = Ceramic_Cap: PartNumber: CC0603KRX7R9BB104; ComponentType: SMD Ceramic Chip Capacitor; Manufacter: *; Tolerance: *; ClassName: *; Value: 0.1uF
C375 = Ceramic_Cap: PartNumber: CC0805KKX7R8BB105; ComponentType: SMD Ceramic Chip Capacitor; Manufacter: *; Tolerance: *; ClassName: *; Value: 1uF
J10 = LCD_CON_30_35: ComponentType: *; Manufacter: *; Package: XF2M30151A; PartNumber: XF2M30151A; ClassName: *; Value: XF2M30151A
R187 = Chip_Res: PartNumber: RC0402FR-07100KL; ComponentType: SMD Chip Resistor; Manufacter: *; Voltage: *; ClassName: *; Value: 100K
R188 R190 = Chip_Res: PartNumber: RC0402FR-0710KL; ComponentType: SMD Chip Resistor; Manufacter: *; Voltage: *; ClassName: *; Value: 10K
R189 = Chip_Res: PartNumber: RC0402FR-071KL; ComponentType: SMD Chip Resistor; Manufacter: *; Voltage: *; ClassName: *; Value: 1K
R191 = Chip_Res: PartNumber: RC0402FR-076K04L; ComponentType: SMD Chip Resistor; Manufacter: *; Voltage: *; ClassName: *; Value: 6K04
R192-R194 = Chip_Res: PartNumber: RC0603FR-070RL; ComponentType: SMD Chip Resistor; Manufacter: *; Voltage: *; ClassName: *
  R192: Value: 0R
  R193 R194: Value: DNP
TP9 TP10 = TP: ComponentType: *; Manufacter: *; Package: TEST POINT SMD 1MM; PartNumber: TEST POINT SMD 1MM; ClassName: *; Value: TEST POINT SMD 1MM
VT3 = MOSFET_P: ComponentType: *; Manufacter: *; Package: SOT23; PartNumber: WM02P30M; ClassName: *
VT4 = NPN_BEC: ComponentType: *; Manufacter: *; Package: SC-70; PartNumber: BC817-40W; ClassName: *; Value: BC817-40W
U1 = RK3399_FF: Package: BGA828; ComponentType: *; Manufacter: *; PartNumber: RK3399; ClassName: *

## Sheet 18 I2S.SchDoc
size 420 x 297 mm; Address1: Address1; Address2: Address2; Address3: Address3; Address4: Address4; DocumentNumber: АБВГ.123456.001 Э3; SheetNumber: 18; SheetTotal: 23; Scale: 1:1; DocumentType: Схема электрическая принципиальная; FirstReferrence: АБВГ.123456.001
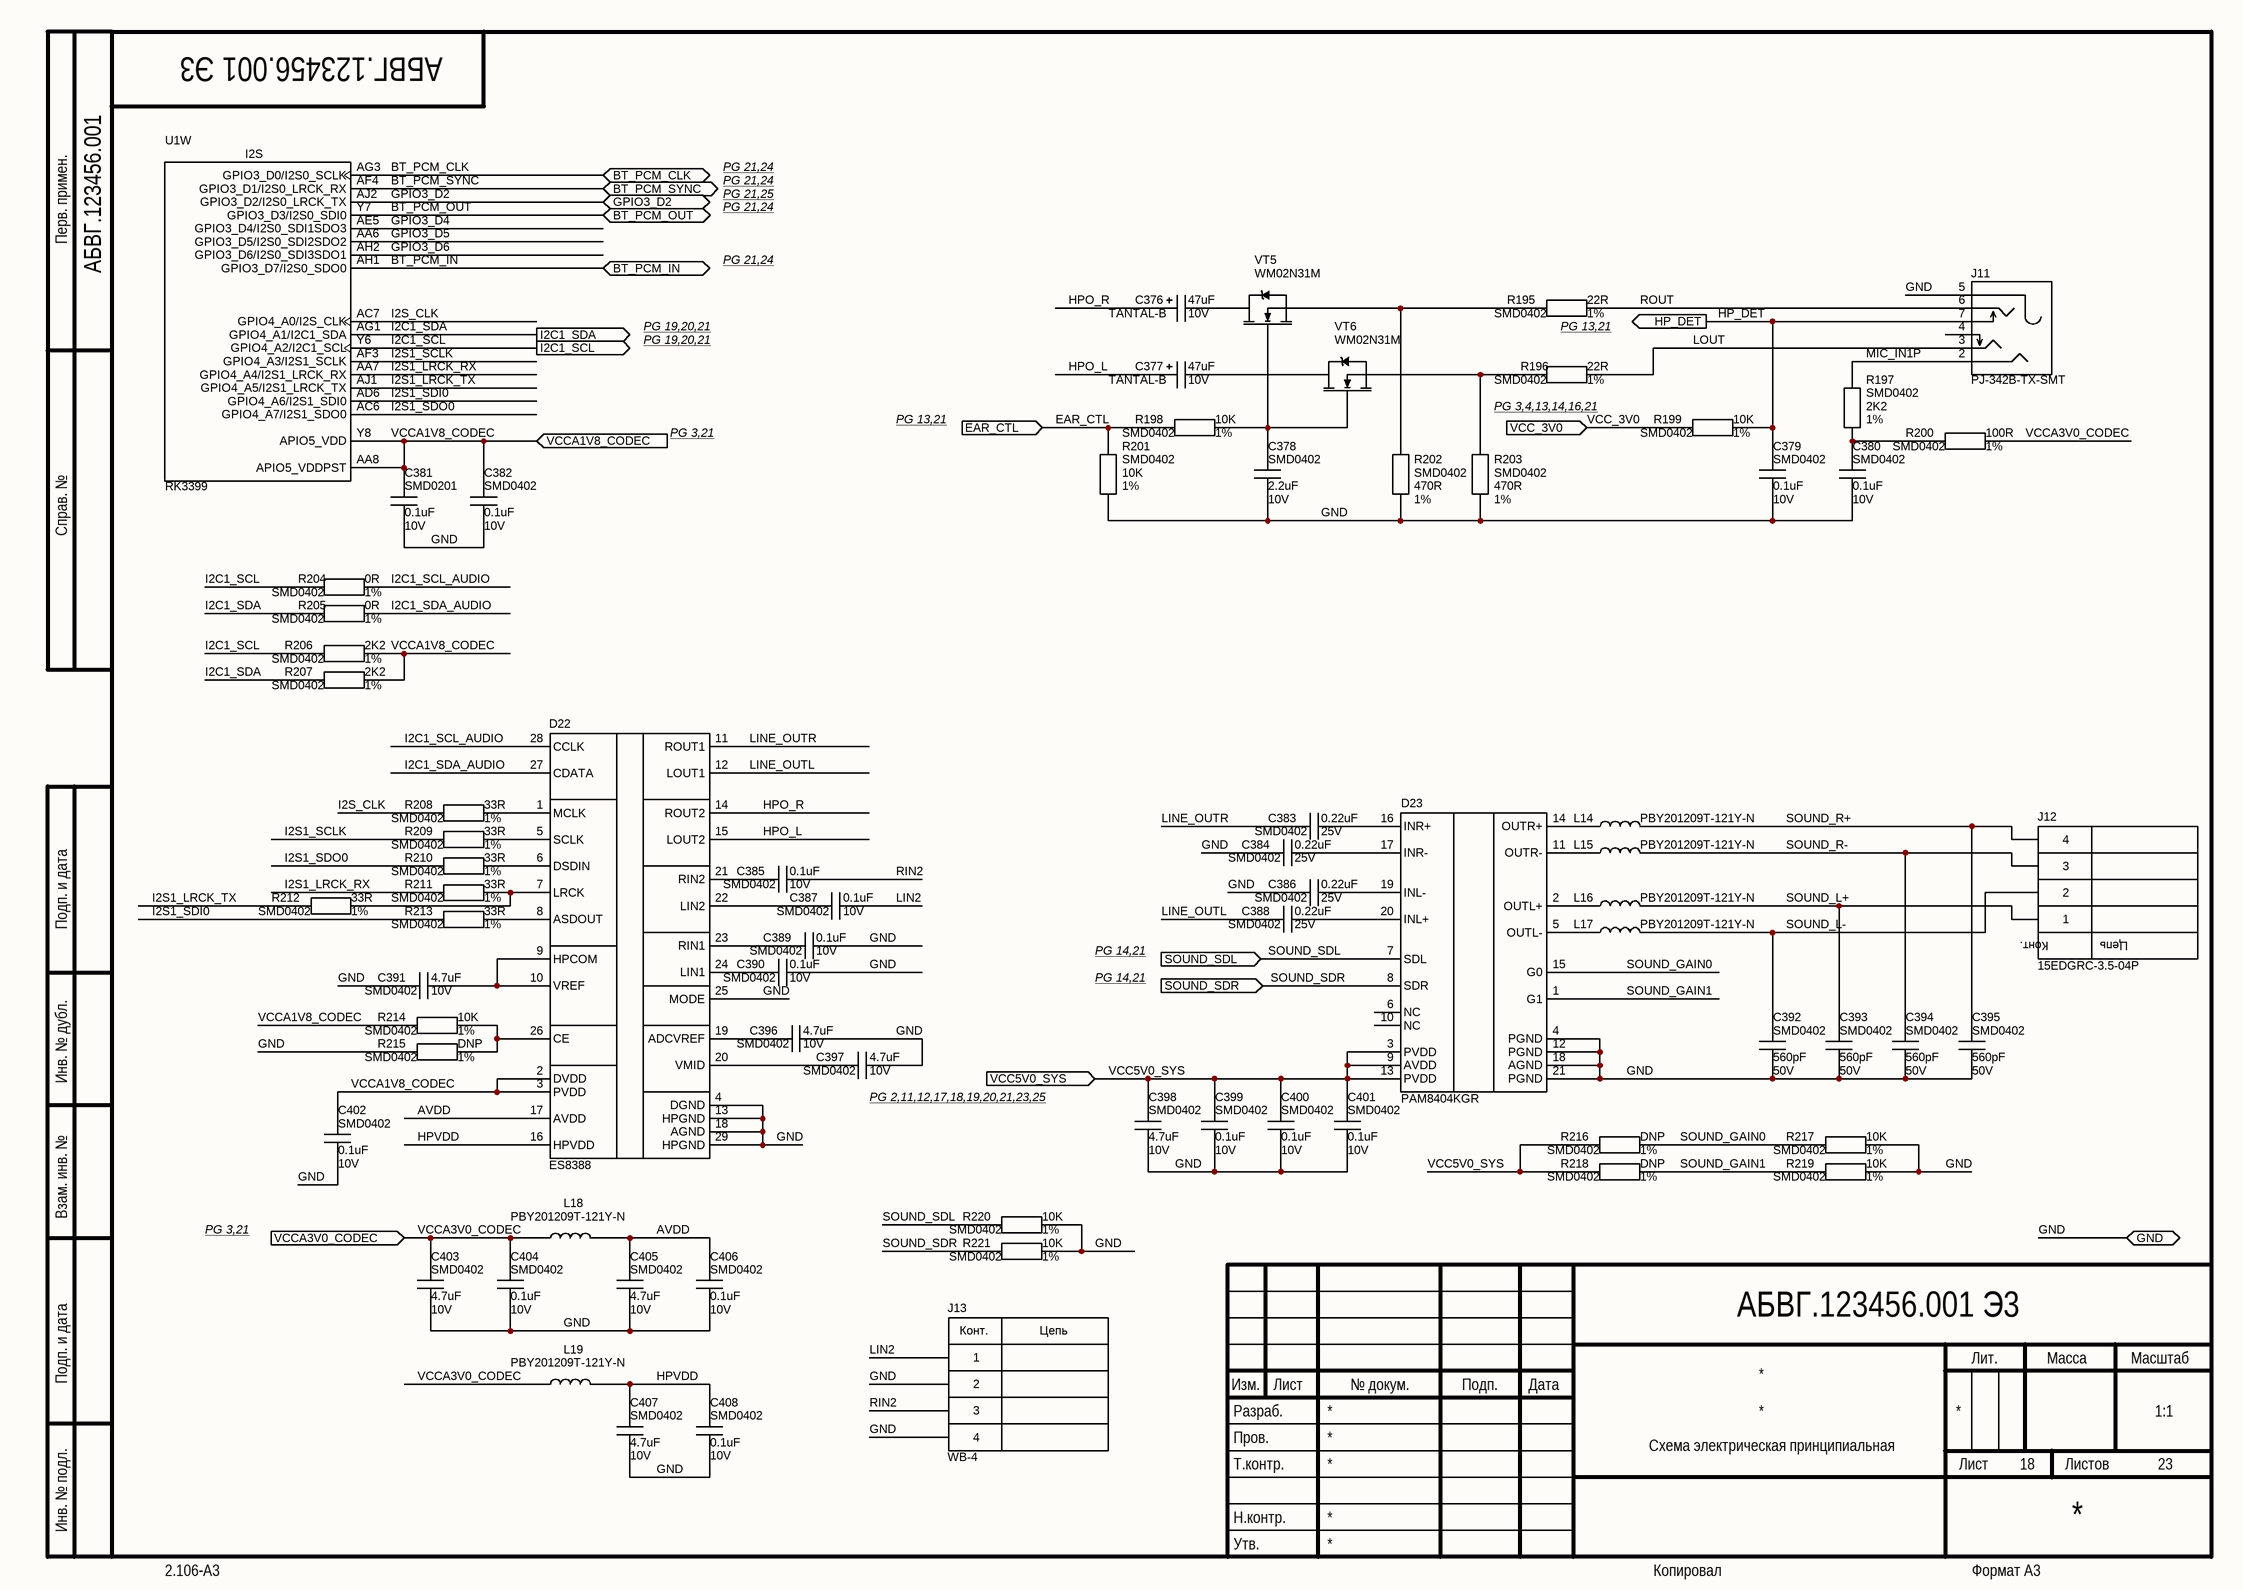
[diagram p17: 18 I2S.SchDoc]

### Parts
C376  Voltage: 10V  [TANTAL-B]  (hidden comment: 47uF)
C377  Voltage: 10V  [TANTAL-B]  (hidden comment: 47uF)
C378  Package: SMD0402  Voltage: 10V  [CAP_SMD_0402]  (hidden comment: 2.2uF)
C379  Package: SMD0402  Voltage: 10V  [CAP_SMD_0402]  (hidden comment: 0.1uF)
C380  Package: SMD0402  Voltage: 10V  [CAP_SMD_0402]  (hidden comment: 0.1uF)
C381  Package: SMD0201  Voltage: 10V  [CAP_SMD_0201]  (hidden comment: 0.1uF)
C382  Package: SMD0402  Voltage: 10V  [CAP_SMD_0402]  (hidden comment: 0.1uF)
C383  Package: SMD0402  Voltage: 25V  [CAP_SMD_0402]  (hidden comment: 0.22uF)
C384  Package: SMD0402  Voltage: 25V  [CAP_SMD_0402]  (hidden comment: 0.22uF)
C385  Package: SMD0402  Voltage: 10V  [CAP_SMD_0402]  (hidden comment: 0.1uF)
C386  Package: SMD0402  Voltage: 25V  [CAP_SMD_0402]  (hidden comment: 0.22uF)
C387  Package: SMD0402  Voltage: 10V  [CAP_SMD_0402]  (hidden comment: 0.1uF)
C388  Package: SMD0402  Voltage: 25V  [CAP_SMD_0402]  (hidden comment: 0.22uF)
C389  Package: SMD0402  Voltage: 10V  [CAP_SMD_0402]  (hidden comment: 0.1uF)
C390  Package: SMD0402  Voltage: 10V  [CAP_SMD_0402]  (hidden comment: 0.1uF)
C391  Package: SMD0402  Voltage: 10V  [CAP_SMD_0402]  (hidden comment: 4.7uF)
C392  Package: SMD0402  Voltage: 50V  [CAP_SMD_0402]  (hidden comment: 560pF)
C393  Package: SMD0402  Voltage: 50V  [CAP_SMD_0402]  (hidden comment: 560pF)
C394  Package: SMD0402  Voltage: 50V  [CAP_SMD_0402]  (hidden comment: 560pF)
C395  Package: SMD0402  Voltage: 50V  [CAP_SMD_0402]  (hidden comment: 560pF)
C396  Package: SMD0402  Voltage: 10V  [CAP_SMD_0402]  (hidden comment: 4.7uF)
C397  Package: SMD0402  Voltage: 10V  [CAP_SMD_0402]  (hidden comment: 4.7uF)
C398  Package: SMD0402  Voltage: 10V  [CAP_SMD_0402]  (hidden comment: 4.7uF)
C399  Package: SMD0402  Voltage: 10V  [CAP_SMD_0402]  (hidden comment: 0.1uF)
C400  Package: SMD0402  Voltage: 10V  [CAP_SMD_0402]  (hidden comment: 0.1uF)
C401  Package: SMD0402  Voltage: 10V  [CAP_SMD_0402]  (hidden comment: 0.1uF)
C402  Package: SMD0402  Voltage: 10V  [CAP_SMD_0402]  (hidden comment: 0.1uF)
C403  Package: SMD0402  Voltage: 10V  [CAP_SMD_0402]  (hidden comment: 4.7uF)
C404  Package: SMD0402  Voltage: 10V  [CAP_SMD_0402]  (hidden comment: 0.1uF)
C405  Package: SMD0402  Voltage: 10V  [CAP_SMD_0402]  (hidden comment: 4.7uF)
C406  Package: SMD0402  Voltage: 10V  [CAP_SMD_0402]  (hidden comment: 0.1uF)
C407  Package: SMD0402  Voltage: 10V  [CAP_SMD_0402]  (hidden comment: 4.7uF)
C408  Package: SMD0402  Voltage: 10V  [CAP_SMD_0402]  (hidden comment: 0.1uF)
D22  ES8388  [QFN-28 4mmx4mm]
D23  PAM8404KGR  [QFN-20 4mmx4mm]
J11  PJ-342B-TX-SMT  [PJ-342B-TX-SMT]
J12  15EDGRC-3.5-04P  [15EDGRC-3.5-04P]
J13  WB-4  [WB-4]
L14  value PBY201209T-121Y-N  [IND_SMD_0805]  (hidden comment: Value)
L15  value PBY201209T-121Y-N  [IND_SMD_0805]  (hidden comment: Value)
L16  value PBY201209T-121Y-N  [IND_SMD_0805]  (hidden comment: Value)
L17  value PBY201209T-121Y-N  [IND_SMD_0805]  (hidden comment: Value)
L18  value PBY201209T-121Y-N  [IND_SMD_0805]  (hidden comment: Value)
L19  value PBY201209T-121Y-N  [IND_SMD_0805]  (hidden comment: Value)
R195  Package: SMD0402  Tolerance: 1%  [RES_SMD_0402]  (hidden comment: 22R)
R196  Package: SMD0402  Tolerance: 1%  [RES_SMD_0402]  (hidden comment: 22R)
R197  Package: SMD0402  Tolerance: 1%  [RES_SMD_0402]  (hidden comment: 2K2)
R198  Package: SMD0402  Tolerance: 1%  [RES_SMD_0402]  (hidden comment: 10K)
R199  Package: SMD0402  Tolerance: 1%  [RES_SMD_0402]  (hidden comment: 10K)
R200  Package: SMD0402  Tolerance: 1%  [RES_SMD_0402]  (hidden comment: 100R)
R201  Package: SMD0402  Tolerance: 1%  [RES_SMD_0402]  (hidden comment: 10K)
R202  Package: SMD0402  Tolerance: 1%  [RES_SMD_0402]  (hidden comment: 470R)
R203  Package: SMD0402  Tolerance: 1%  [RES_SMD_0402]  (hidden comment: 470R)
R204  Package: SMD0402  Tolerance: 1%  [RES_SMD_0402]  (hidden comment: 0R)
R205  Package: SMD0402  Tolerance: 1%  [RES_SMD_0402]  (hidden comment: 0R)
R206  Package: SMD0402  Tolerance: 1%  [RES_SMD_0402]  (hidden comment: 2K2)
R207  Package: SMD0402  Tolerance: 1%  [RES_SMD_0402]  (hidden comment: 2K2)
R208  Package: SMD0402  Tolerance: 1%  [RES_SMD_0402]  (hidden comment: 33R)
R209  Package: SMD0402  Tolerance: 1%  [RES_SMD_0402]  (hidden comment: 33R)
R210  Package: SMD0402  Tolerance: 1%  [RES_SMD_0402]  (hidden comment: 33R)
R211  Package: SMD0402  Tolerance: 1%  [RES_SMD_0402]  (hidden comment: 33R)
R212  Package: SMD0402  Tolerance: 1%  [RES_SMD_0402]  (hidden comment: 33R)
R213  Package: SMD0402  Tolerance: 1%  [RES_SMD_0402]  (hidden comment: 33R)
R214  Package: SMD0402  Tolerance: 1%  [RES_SMD_0402]  (hidden comment: 10K)
R215  Package: SMD0402  Tolerance: 1%  [RES_SMD_0402]  (hidden comment: DNP)
R216  Package: SMD0402  Tolerance: 1%  [RES_SMD_0402]  (hidden comment: DNP)
R217  Package: SMD0402  Tolerance: 1%  [RES_SMD_0402]  (hidden comment: 10K)
R218  Package: SMD0402  Tolerance: 1%  [RES_SMD_0402]  (hidden comment: DNP)
R219  Package: SMD0402  Tolerance: 1%  [RES_SMD_0402]  (hidden comment: 10K)
R220  Package: SMD0402  Tolerance: 1%  [RES_SMD_0402]  (hidden comment: 10K)
R221  Package: SMD0402  Tolerance: 1%  [RES_SMD_0402]  (hidden comment: 10K)
U1  value RK3399  [BGA828C65P31X31_2100X2100X161N]  (hidden comment: RK3399_FF)  (part W of 23)
VT5  value WM02N31M  [SOT23]  (hidden comment: Value)
VT6  value WM02N31M  [SOT23]  (hidden comment: Value)

### Ports
BT_PCM_CLK (bidir), BT_PCM_IN (bidir), BT_PCM_OUT (bidir), BT_PCM_SYNC (bidir), EAR_CTL (in), GND (bidir), GPIO3_D2 (bidir), HP_DET (out), I2C1_SCL (out), I2C1_SDA (out), SOUND_SDL (in), SOUND_SDR (in), VCC5V0_SYS (in), VCC_3V0 (in), VCCA1V8_CODEC (in), VCCA3V0_CODEC (in)

### Nets
AVDD: C405.2 C406.1 D22.17(AVDD) L18.1
BT_PCM_CLK: U1.AG3(GPIO3_D0/I2S0_SCLK) ; port BT_PCM_CLK
BT_PCM_IN: U1.AH1(GPIO3_D7/I2S0_SDO0) ; port BT_PCM_IN
BT_PCM_OUT: U1.Y7(GPIO3_D3/I2S0_SDI0) ; port BT_PCM_OUT
BT_PCM_SYNC: U1.AF4(GPIO3_D1/I2S0_LRCK_RX) ; port BT_PCM_SYNC
EAR_CTL: R198.2 R201.1 ; port EAR_CTL
GND: C378.1 C379.2 C380.2 C381.2 C382.2 C384.2 C386.2 C389.2 C390.2 C391.1 C392.2 C393.2 C394.2 C395.2 C396.2 C397.2 C398.1 C399.2 C400.2 C401.2 C402.2 C403.1 C404.2 C405.1 C406.2 C407.1 C408.2 D22.4(DGND) D22.13(HPGND) D22.18(AGND) D22.25(MODE) D22.29(HPGND) D23.4(PGND) D23.12(PGND) D23.18(AGND) D23.21(PGND) J11.5 J13.2 J13.4 R201.2 R202.1 R203.1 R215.1 R217.1 R219.1 R220.1 R221.1 ; port GND
GPIO3_D2: U1.AJ2(GPIO3_D2/I2S0_LRCK_TX) ; port GPIO3_D2
GPIO3_D4: U1.AE5(GPIO3_D4/I2S0_SDI1SDO3)
GPIO3_D5: U1.AA6(GPIO3_D5/I2S0_SDI2SDO2)
GPIO3_D6: U1.AH2(GPIO3_D6/I2S0_SDI3SDO1)
HP_DET: C379.1 J11.7 R199.1 ; port HP_DET
HPO_L: C377.1 D22.15(LOUT2)
HPO_R: C376.1 D22.14(ROUT2)
HPVDD: C407.2 C408.1 D22.16(HPVDD) L19.1
I2C1_SCL: R204.1 R206.2 U1.Y6(GPIO4_A2/I2C1_SCL) ; port I2C1_SCL
I2C1_SCL_AUDIO: D22.28(CCLK) R204.2
I2C1_SDA: R205.1 R207.2 U1.AG1(GPIO4_A1/I2C1_SDA) ; port I2C1_SDA
I2C1_SDA_AUDIO: D22.27(CDATA) R205.2
I2S1_LRCK_RX: R211.1 U1.AA7(GPIO4_A4/I2S1_LRCK_RX)
I2S1_LRCK_TX: R212.1 U1.AJ1(GPIO4_A5/I2S1_LRCK_TX)
I2S1_SCLK: R209.1 U1.AF3(GPIO4_A3/I2S1_SCLK)
I2S1_SDI0: R213.1 U1.AD6(GPIO4_A6/I2S1_SDI0)
I2S1_SDO0: R210.1 U1.AC6(GPIO4_A7/I2S1_SDO0)
I2S_CLK: R208.1 U1.AC7(GPIO4_A0/I2S_CLK)
LIN2: C387.2 J13.1
LINE_OUTL: C388.2 D22.12(LOUT1)
LINE_OUTR: C383.2 D22.11(ROUT1)
LOUT: J11.3 R196.1
MIC_IN1P: J11.2 R197.2
RIN2: C385.2 J13.3
ROUT: J11.6 R195.1
SOUND_GAIN0: D23.15(G0) R216.2 R217.2
SOUND_GAIN1: D23.1(G1) R218.2 R219.2
SOUND_L+: C393.1 J12.1 L16.1
SOUND_L-: C392.1 J12.2 L17.1
SOUND_R+: C395.1 J12.4 L14.1
SOUND_R-: C394.1 J12.3 L15.1
SOUND_SDL: D23.7(SDL) R220.2 ; port SOUND_SDL
SOUND_SDR: D23.8(SDR) R221.2 ; port SOUND_SDR
VCC5V0_SYS: C398.2 C399.1 C400.1 C401.1 D23.3(PVDD) D23.9(AVDD) D23.13(PVDD) R216.1 R218.1 ; port VCC5V0_SYS
VCC_3V0: R199.2 ; port VCC_3V0
VCCA1V8_CODEC: C381.1 C382.1 C402.1 D22.2(DVDD) D22.3(PVDD) R206.1 R207.1 R214.2 U1.AA8(APIO5_VDDPST) U1.Y8(APIO5_VDD) ; port VCCA1V8_CODEC
VCCA3V0_CODEC: C403.2 C404.1 L18.2 L19.2 R200.2 ; port VCCA3V0_CODEC
NetC376_2: C376.2 VT5.3(D)
NetC377_2: C377.2 VT6.3(D)
NetC378_2: C378.2 R198.1 VT5.1(G) VT6.1(G)
NetC380_1: C380.1 R197.1 R200.1
NetC383_1: C383.1 D23.16(INR+)
NetC384_1: C384.1 D23.17(INR-)
NetC385_1: C385.1 D22.21(RIN2)
NetC386_1: C386.1 D23.19(INL-)
NetC387_1: C387.1 D22.22(LIN2)
NetC388_1: C388.1 D23.20(INL+)
NetC389_1: C389.1 D22.23(RIN1)
NetC390_1: C390.1 D22.24(LIN1)
NetC391_2: C391.2 D22.9(HPCOM) D22.10(VREF)
NetC396_1: C396.1 D22.19(ADCVREF)
NetC397_1: C397.1 D22.20(VMID)
NetD22_1: D22.1(MCLK) R208.2
NetD22_5: D22.5(SCLK) R209.2
NetD22_6: D22.6(DSDIN) R210.2
NetD22_7: D22.7(LRCK) R211.2 R212.2
NetD22_8: D22.8(ASDOUT) R213.2
NetD22_26: D22.26(CE) R214.1 R215.2
NetD23_2: D23.2(OUTL+) L16.2
NetD23_5: D23.5(OUTL-) L17.2
NetD23_11: D23.11(OUTR-) L15.2
NetD23_14: D23.14(OUTR+) L14.2
NetR195_2: R195.2 R202.2 VT5.2(S)
NetR196_2: R196.2 R203.2 VT6.2(S)

Not connected (* = marked no-connect by the designer): D23 6(NC) 10(NC); J11 4

### Notes on the sheet
- PG 21,24
- Перв. примен.
- PG 21,25
- PG 19,20,21
- (near R195) PG 13,21
- PG 3,21
- PG 13,21
- PG 3,4,13,14,16,21
- Справ. №
- Подп. и дата
- PG 14,21
- Инв. № дубл.
- (near C397) PG 2,11,12,17,18,19,20,21,23,25
- Взам. инв. №
- Разраб.
- Изм.
- Лист
- № докум.
- Подп.
- Дата
- Лит.
- Масса
- Масштаб
- Пров.
- Т.контр.
- Листов
- Инв. № подл.
- Утв.
- Н.контр.
- 2.106-A3
- Копировал
- Формат А3
- (in symbol CON4) Конт.; Цепь
- (in symbol RK3399_FF, part W) I2S

### Library data of the parts
C376 C377 = Tantal: PartNumber: CA45L-B010K476TE500; Tolerance: 20%; Manufacturer: *; ComponentType: SMD Tantalum Chip Capacitor; ClassName: *; Package: TANTAL-B; Value: 47uF
C378 = Ceramic_Cap: PartNumber: CC0402KRX5R6BB225; ComponentType: SMD Ceramic Chip Capacitor; Manufacter: *; Tolerance: *; ClassName: *; Value: 2.2uF
C379 C380 C382 C385 C387 C389 C390 C399-C402 C404 C406 C408 = Ceramic_Cap: PartNumber: CC0402KRX5R6BB104; ComponentType: SMD Ceramic Chip Capacitor; Manufacter: *; Tolerance: *; ClassName: *; Value: 0.1uF
C381 = Ceramic_Cap: PartNumber: CC0201KRX5R6BB104; ComponentType: SMD Ceramic Chip Capacitor; Manufacter: *; Tolerance: *; ClassName: *; Value: 0.1uF
C383 C384 C386 C388 = Ceramic_Cap: PartNumber: CC0402KRX5R8BB224; ComponentType: SMD Ceramic Chip Capacitor; Manufacter: *; Tolerance: *; ClassName: *; Value: 0.22uF
C391 C396-C398 C403 C405 C407 = Ceramic_Cap: PartNumber: CL05A475KP5NRNC; ComponentType: SMD Ceramic Chip Capacitor; Manufacter: *; Tolerance: *; ClassName: *; Value: 4.7uF
C392-C395 = Ceramic_Cap: PartNumber: CC0402JRX7R9BB561; ComponentType: SMD Ceramic Chip Capacitor; Manufacter: *; Tolerance: *; ClassName: *; Value: 560pF
J12 = CON4: Manufacter: *; Package: 15EDGRC-3.5-04P; PartNumber: 15EDGRC-3.5-04P; ClassName: *; Value: 15EDGRC-3.5-04P
J13 = CON4: PartNumber: DS1066-04M(MW-4M); Manufacter: *; Package: WB-4; ClassName: *; Value: WB-4
L14-L19 = Inductor_smal: ComponentType: *; Manufacter: *; Package: SMD0805; PartNumber: PBY201209T-121Y-N; ClassName: *
R195 R196 = Chip_Res: PartNumber: RC0402FR-0722RL; ComponentType: SMD Chip Resistor; Manufacter: *; Voltage: *; ClassName: *; Value: 22R
R197 R206 R207 = Chip_Res: PartNumber: RC0402FR-072K2L; ComponentType: SMD Chip Resistor; Manufacter: *; Voltage: *; ClassName: *; Value: 2K2
R198 R199 R201 R214 R217 R219-R221 = Chip_Res: PartNumber: RC0402FR-0710KL; ComponentType: SMD Chip Resistor; Manufacter: *; Voltage: *; ClassName: *; Value: 10K
R200 = Chip_Res: PartNumber: RC0402FR-07100RL; ComponentType: SMD Chip Resistor; Manufacter: *; Voltage: *; ClassName: *; Value: 100R
R202 R203 = Chip_Res: PartNumber: RC0402FR-07470RL; ComponentType: SMD Chip Resistor; Manufacter: *; Voltage: *; ClassName: *; Value: 470R
R204 R205 = Chip_Res: PartNumber: RC0402FR-070RL; ComponentType: SMD Chip Resistor; Manufacter: *; Voltage: *; ClassName: *; Value: 0R
R208-R213 = Chip_Res: PartNumber: RC0402FR-0733RL; ComponentType: SMD Chip Resistor; Manufacter: *; Voltage: *; ClassName: *; Value: 33R
R215 R216 R218 = Chip_Res: PartNumber: Do Not Place; ComponentType: SMD Chip Resistor; Manufacter: *; Voltage: *; ClassName: *; Value: DNP
VT5 VT6 = MOSFET_N: ComponentType: *; Manufacter: *; Package: SOT23; PartNumber: WM02N31M; ClassName: *
D22 = ES8388: ComponentType: SMD Chip Resistor; Manufacter: *; Voltage: *; ClassName: *; Tolerance: *; PartNumber: ES8388; Package: QFN-28; Value: ES8388
D23 = PAM8404KGR: ComponentType: SMD Chip Resistor; Manufacter: *; Voltage: *; ClassName: *; Tolerance: *; PartNumber: PAM8404KGR; Package: QFN-20; Value: PAM8404KGR
J11 = PJ-342B-TX-SMT: ComponentType: SMD Chip Resistor; Manufacter: *; Voltage: *; ClassName: *; Tolerance: *; PartNumber: PJ-342B-TX-SMT; Package: PJ-342B-TX-SMT; Value: PJ-342B-TX-SMT
U1 = RK3399_FF: Package: BGA828; ComponentType: *; Manufacter: *; PartNumber: RK3399; ClassName: *

## Sheet 19 RADIATOR.SchDoc
size 420 x 297 mm; Address1: Address1; Address2: Address2; Address3: Address3; Address4: Address4; DocumentNumber: АБВГ.123456.001 Э3; SheetNumber: 19; SheetTotal: 23; Scale: 1:1; DocumentType: Схема электрическая принципиальная; FirstReferrence: АБВГ.123456.001
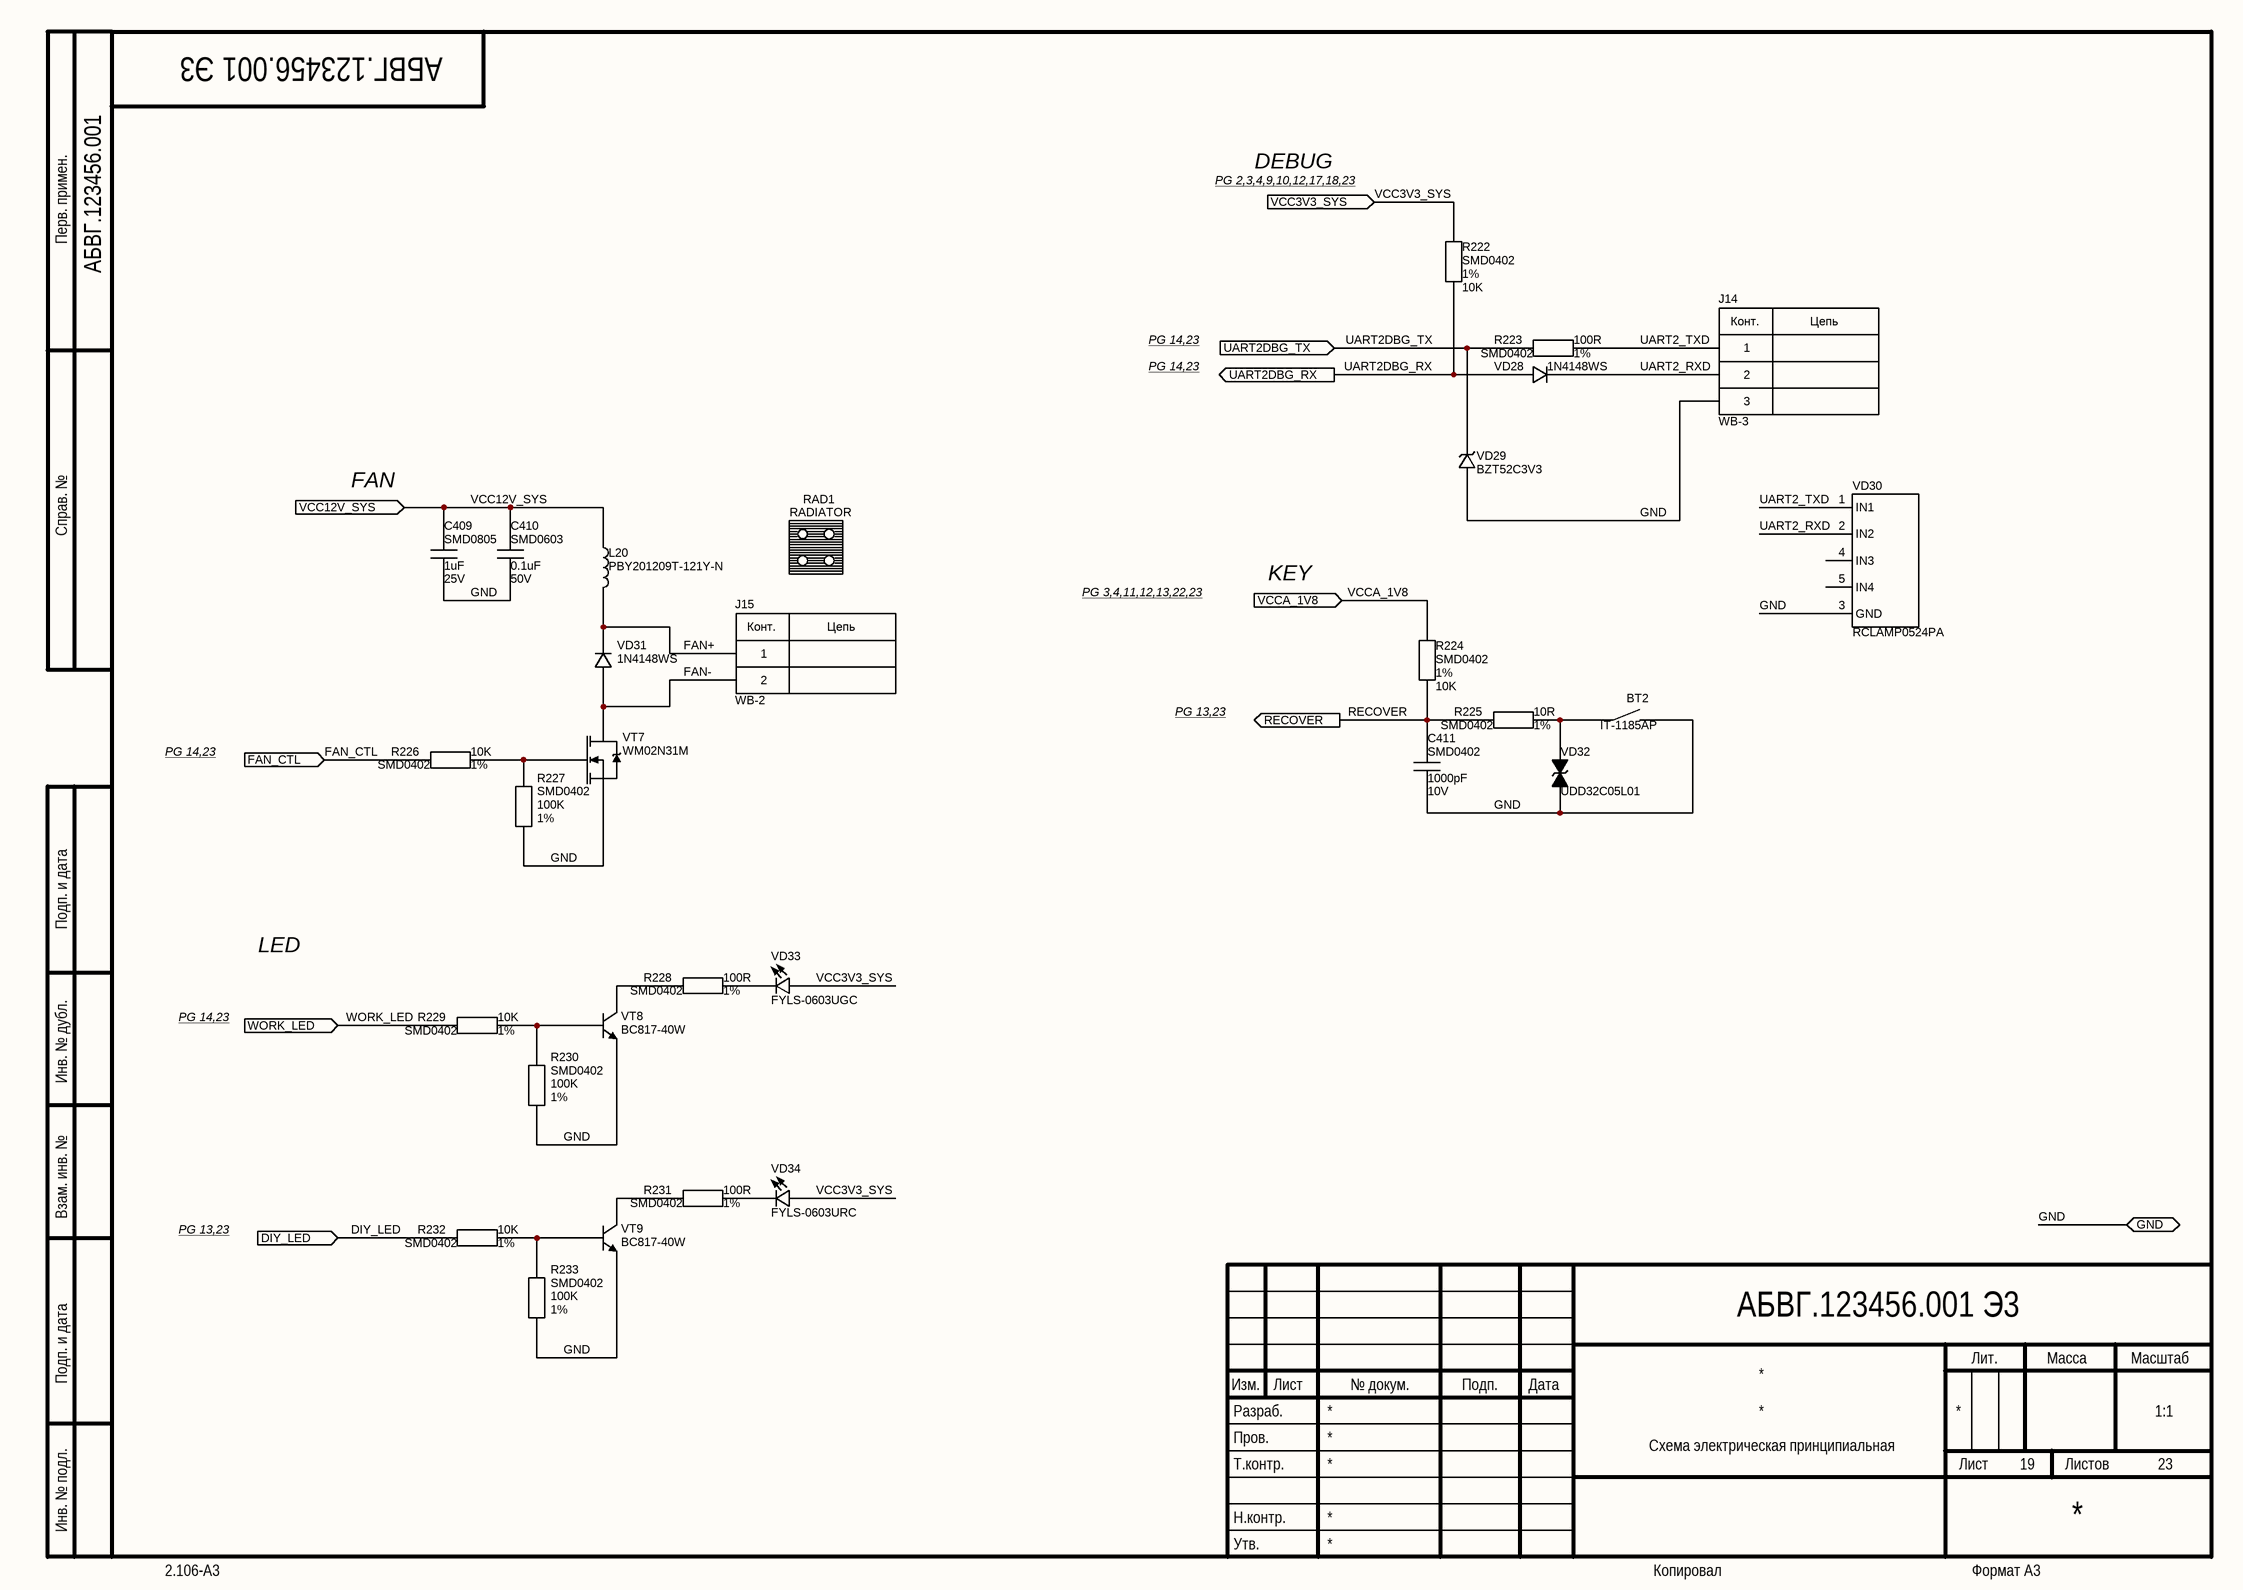
[diagram p18: 19 RADIATOR.SchDoc]

### Parts
BT2  IT-1185AP  [IT-1185AP]
C409  Package: SMD0805  Voltage: 25V  [CAP_SMD_0805]  (hidden comment: 1uF)
C410  Package: SMD0603  Voltage: 50V  [CAP_SMD_0603]  (hidden comment: 0.1uF)
C411  Package: SMD0402  Voltage: 10V  [CAP_SMD_0402]  (hidden comment: 1000pF)
J14  WB-3  [WB-3]
J15  WB-2  [WB-2]
L20  value PBY201209T-121Y-N  [IND_SMD_0805]  (hidden comment: Value)
R222  Package: SMD0402  Tolerance: 1%  [RES_SMD_0402]  (hidden comment: 10K)
R223  Package: SMD0402  Tolerance: 1%  [RES_SMD_0402]  (hidden comment: 100R)
R224  Package: SMD0402  Tolerance: 1%  [RES_SMD_0402]  (hidden comment: 10K)
R225  Package: SMD0402  Tolerance: 1%  [RES_SMD_0402]  (hidden comment: 10R)
R226  Package: SMD0402  Tolerance: 1%  [RES_SMD_0402]  (hidden comment: 10K)
R227  Package: SMD0402  Tolerance: 1%  [RES_SMD_0402]  (hidden comment: 100K)
R228  Package: SMD0402  Tolerance: 1%  [RES_SMD_0402]  (hidden comment: 100R)
R229  Package: SMD0402  Tolerance: 1%  [RES_SMD_0402]  (hidden comment: 10K)
R230  Package: SMD0402  Tolerance: 1%  [RES_SMD_0402]  (hidden comment: 100K)
R231  Package: SMD0402  Tolerance: 1%  [RES_SMD_0402]  (hidden comment: 100R)
R232  Package: SMD0402  Tolerance: 1%  [RES_SMD_0402]  (hidden comment: 10K)
R233  Package: SMD0402  Tolerance: 1%  [RES_SMD_0402]  (hidden comment: 100K)
RAD1  RADIATOR  [RK3399_RADIATOR_2]
VD28  value 1N4148WS  [SOD323]  (hidden comment: Diode)
VD29  BZT52C3V3  [SOD323]
VD30  RCLAMP0524PA  [RCLAMP0524PA]
VD31  value 1N4148WS  [SOD323]  (hidden comment: Diode)
VD32  value UDD32C05L01  [SOD323]  (hidden comment: TVS_Diode)
VD33  FYLS-0603UGC  [LED_0603]
VD34  FYLS-0603URC  [LED_0603]
VT7  value WM02N31M  [SOT23]  (hidden comment: Value)
VT8  BC817-40W  [SC-70]
VT9  BC817-40W  [SC-70]

### Ports
DIY_LED (in), FAN_CTL (in), GND (bidir), RECOVER (out), UART2DBG_RX (out), UART2DBG_TX (in), VCC3V3_SYS (in), VCC12V_SYS (in), VCCA_1V8 (in), WORK_LED (in)

### Nets
DIY_LED: R232.2 ; port DIY_LED
FAN+: J15.1 L20.1 VD31.2(C)
FAN-: J15.2 VD31.1(A) VT7.3(D)
FAN_CTL: R226.2 ; port FAN_CTL
GND: BT2.2 C409.1 C410.1 C411.1 J14.3 R227.1 R230.1 R233.1 VD29.1(A) VD30.3(GND) VD32.1(A) VT7.2(S) VT8.2(E) VT9.2(E) ; port GND
RECOVER: C411.2 R224.1 R225.1 ; port RECOVER
UART2_RXD: J14.2 VD28.2(C) VD30.2(IN2)
UART2_TXD: J14.1 R223.2 VD30.1(IN1)
UART2DBG_RX: R222.1 VD28.1(A) ; port UART2DBG_RX
UART2DBG_TX: R223.1 VD29.2(C) ; port UART2DBG_TX
VCC3V3_SYS: R222.2 VD33.1(A) VD34.1(A) ; port VCC3V3_SYS
VCC12V_SYS: C409.2 C410.2 L20.2 ; port VCC12V_SYS
VCCA_1V8: R224.2 ; port VCCA_1V8
WORK_LED: R229.2 ; port WORK_LED
NetBT2_1: BT2.1 R225.2 VD32.2(C)
NetR226_1: R226.1 R227.2 VT7.1(G)
NetR228_1: R228.1 VT8.3(C)
NetR228_2: R228.2 VD33.2(C)
NetR229_1: R229.1 R230.2 VT8.1(B)
NetR231_1: R231.1 VT9.3(C)
NetR231_2: R231.2 VD34.2(C)
NetR232_1: R232.1 R233.2 VT9.1(B)

Not connected (* = marked no-connect by the designer): RAD1 1 2 3 4; VD30 4(IN3) 5(IN4)

### Notes on the sheet
- PG 2,3,4,9,10,12,17,18,23
- DEBUG
- Перв. примен.
- PG 14,23
- Справ. №
- FAN
- PG 3,4,11,12,13,22,23
- KEY
- PG 13,23
- Подп. и дата
- LED
- Инв. № дубл.
- Взам. инв. №
- Разраб.
- Изм.
- Лист
- № докум.
- Подп.
- Дата
- Лит.
- Масса
- Масштаб
- Пров.
- Т.контр.
- Листов
- Инв. № подл.
- Утв.
- Н.контр.
- 2.106-A3
- Копировал
- Формат А3
- (in symbol CON2) Конт.; Цепь
- (in symbol CON3) Конт.; Цепь

### Library data of the parts
BT2 = Button_2pin: ComponentType: *; Manufacter: *; Package: IT-1185AP; PartNumber: IT-1185AP; ClassName: *; Value: IT-1185AP
C409 = Ceramic_Cap: PartNumber: CC0805KKX7R8BB105; ComponentType: SMD Ceramic Chip Capacitor; Manufacter: *; Tolerance: *; ClassName: *; Value: 1uF
C410 = Ceramic_Cap: PartNumber: CC0603KRX7R9BB104; ComponentType: SMD Ceramic Chip Capacitor; Manufacter: *; Tolerance: *; ClassName: *; Value: 0.1uF
C411 = Ceramic_Cap: PartNumber: CC0402KRX7R9BB102; ComponentType: SMD Ceramic Chip Capacitor; Manufacter: *; Tolerance: *; ClassName: *; Value: 1000pF
J14 = CON3: PartNumber: DS1066-03M(MW-3M); Manufacter: *; Package: WB-3; ClassName: *; Value: WB-3
J15 = CON2: PartNumber: DS1066-02M(MW-2M); ComponentType: *; Manufacter: *; Package: WB-2; ClassName: *; Value: WB-2
L20 = Inductor_smal: ComponentType: *; Manufacter: *; Package: SMD0805; PartNumber: PBY201209T-121Y-N; ClassName: *
R222 R224 R226 R229 R232 = Chip_Res: PartNumber: RC0402FR-0710KL; ComponentType: SMD Chip Resistor; Manufacter: *; Voltage: *; ClassName: *; Value: 10K
R223 R228 R231 = Chip_Res: PartNumber: RC0402FR-07100RL; ComponentType: SMD Chip Resistor; Manufacter: *; Voltage: *; ClassName: *; Value: 100R
R225 = Chip_Res: PartNumber: RC0402FR-0710RL; ComponentType: SMD Chip Resistor; Manufacter: *; Voltage: *; ClassName: *; Value: 10R
R227 R230 R233 = Chip_Res: PartNumber: RC0402FR-07100KL; ComponentType: SMD Chip Resistor; Manufacter: *; Voltage: *; ClassName: *; Value: 100K
RAD1 = RK3399_RADIATOR_1: ComponentType: SMD Chip Resistor; Manufacter: *; Voltage: *; ClassName: *; Tolerance: *; PartNumber: *; Package: RADIATOR _6x5.2mm; Value: RADIATOR
VD29 = ZenerDiode: ComponentType: *; Manufacter: *; Package: SOD323; PartNumber: BZT52C3V3; ClassName: *; Value: BZT52C3V3
VD33 VD34 = LED: ComponentType: *; Manufacter: *; Package: SMD0603
  VD33: PartNumber: FYLS-0603UGC; Value: FYLS-0603UGC
  VD34: PartNumber: FYLS-0603URC; Value: FYLS-0603URC
VT7 = MOSFET_N: ComponentType: *; Manufacter: *; Package: SOT23; PartNumber: WM02N31M; ClassName: *
VT8 VT9 = NPN_BEC: ComponentType: *; Manufacter: *; Package: SC-70; PartNumber: BC817-40W; ClassName: *; Value: BC817-40W
VD28 VD31 = Diode: ComponentType: *; Manufacter: *; Package: SOD323; PartNumber: 1N4148WS; ClassName: *
VD30 = RCLAMP0524PA: ComponentType: *; Manufacter: *; Package: RCLAMP0524PA; PartNumber: RCLAMP0524PA; ClassName: *; Value: RCLAMP0524PA
VD32 = TVS_Diode: ComponentType: *; Manufacter: *; Package: SOD323; PartNumber: UDD32C05L01; ClassName: *